# EAGLE board RAMBo (EAGLE 6.5.0), part 1 of 3
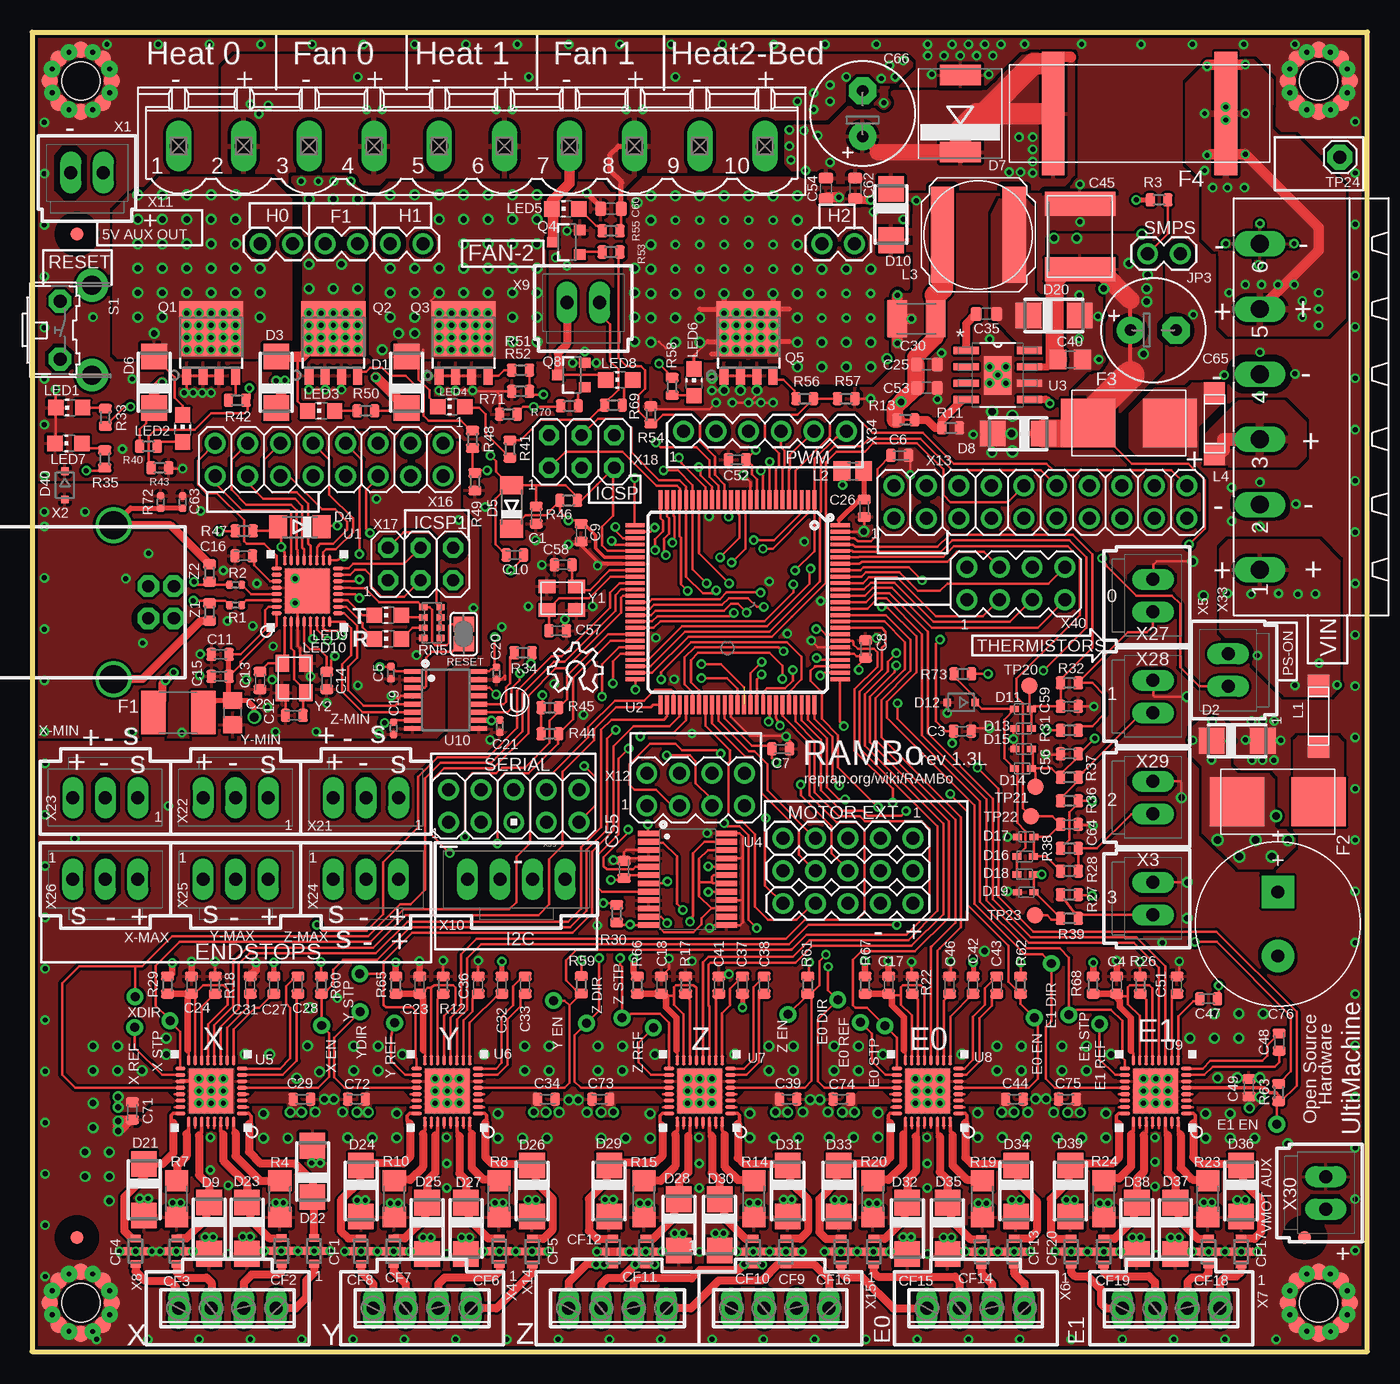
[diagram p1: board, top side]
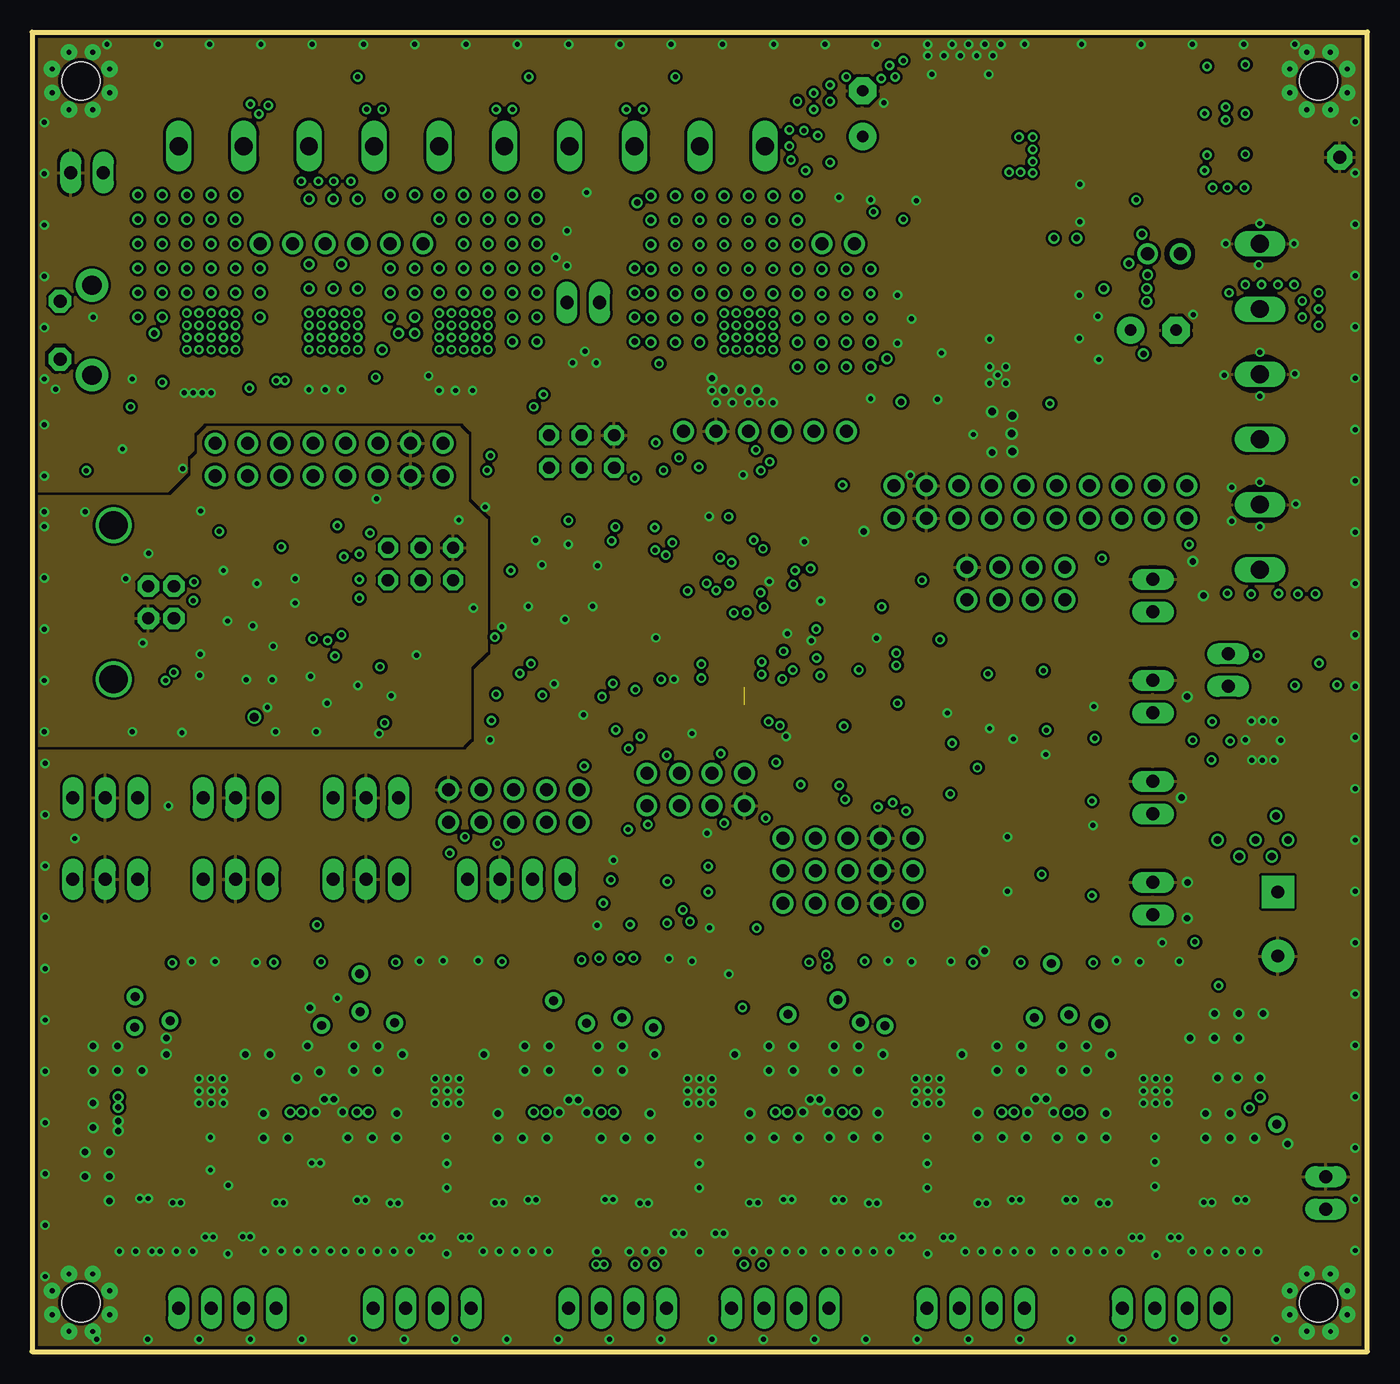
[diagram p2: board, inner layer 2-GND]
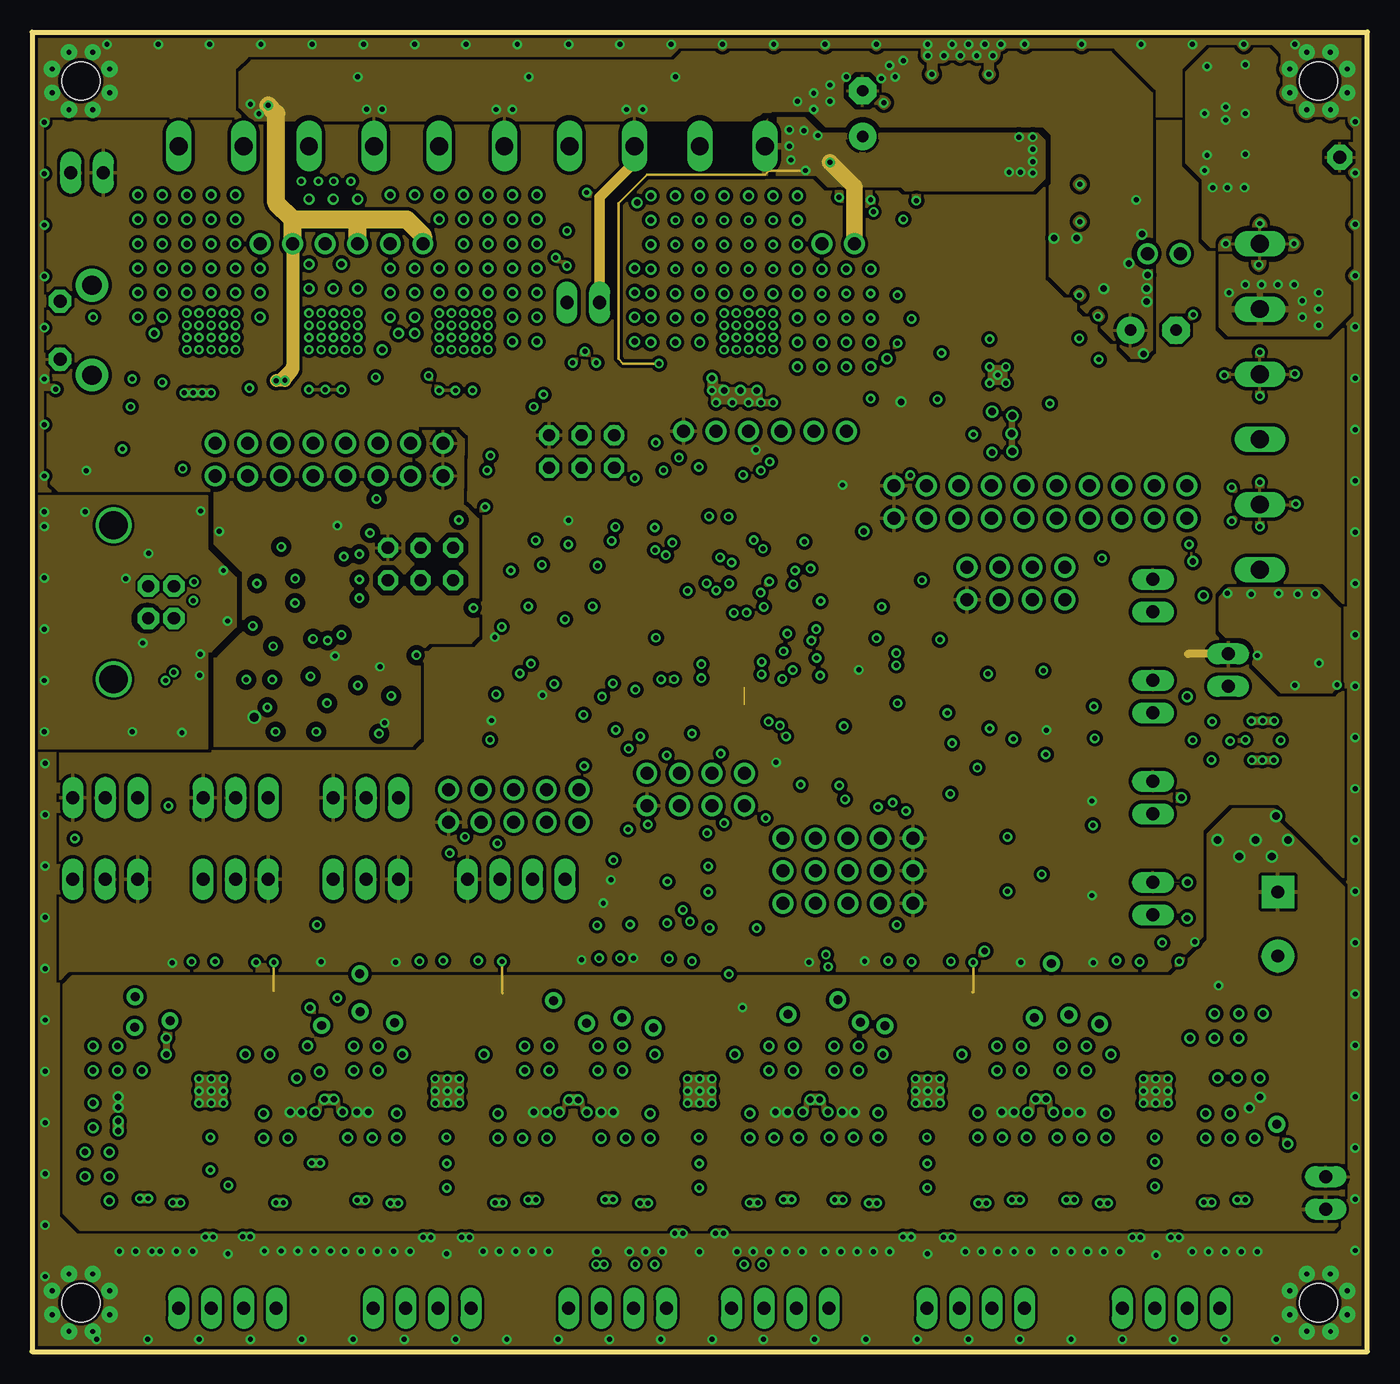
[diagram p3: board, inner layer 15-SUPPLY]
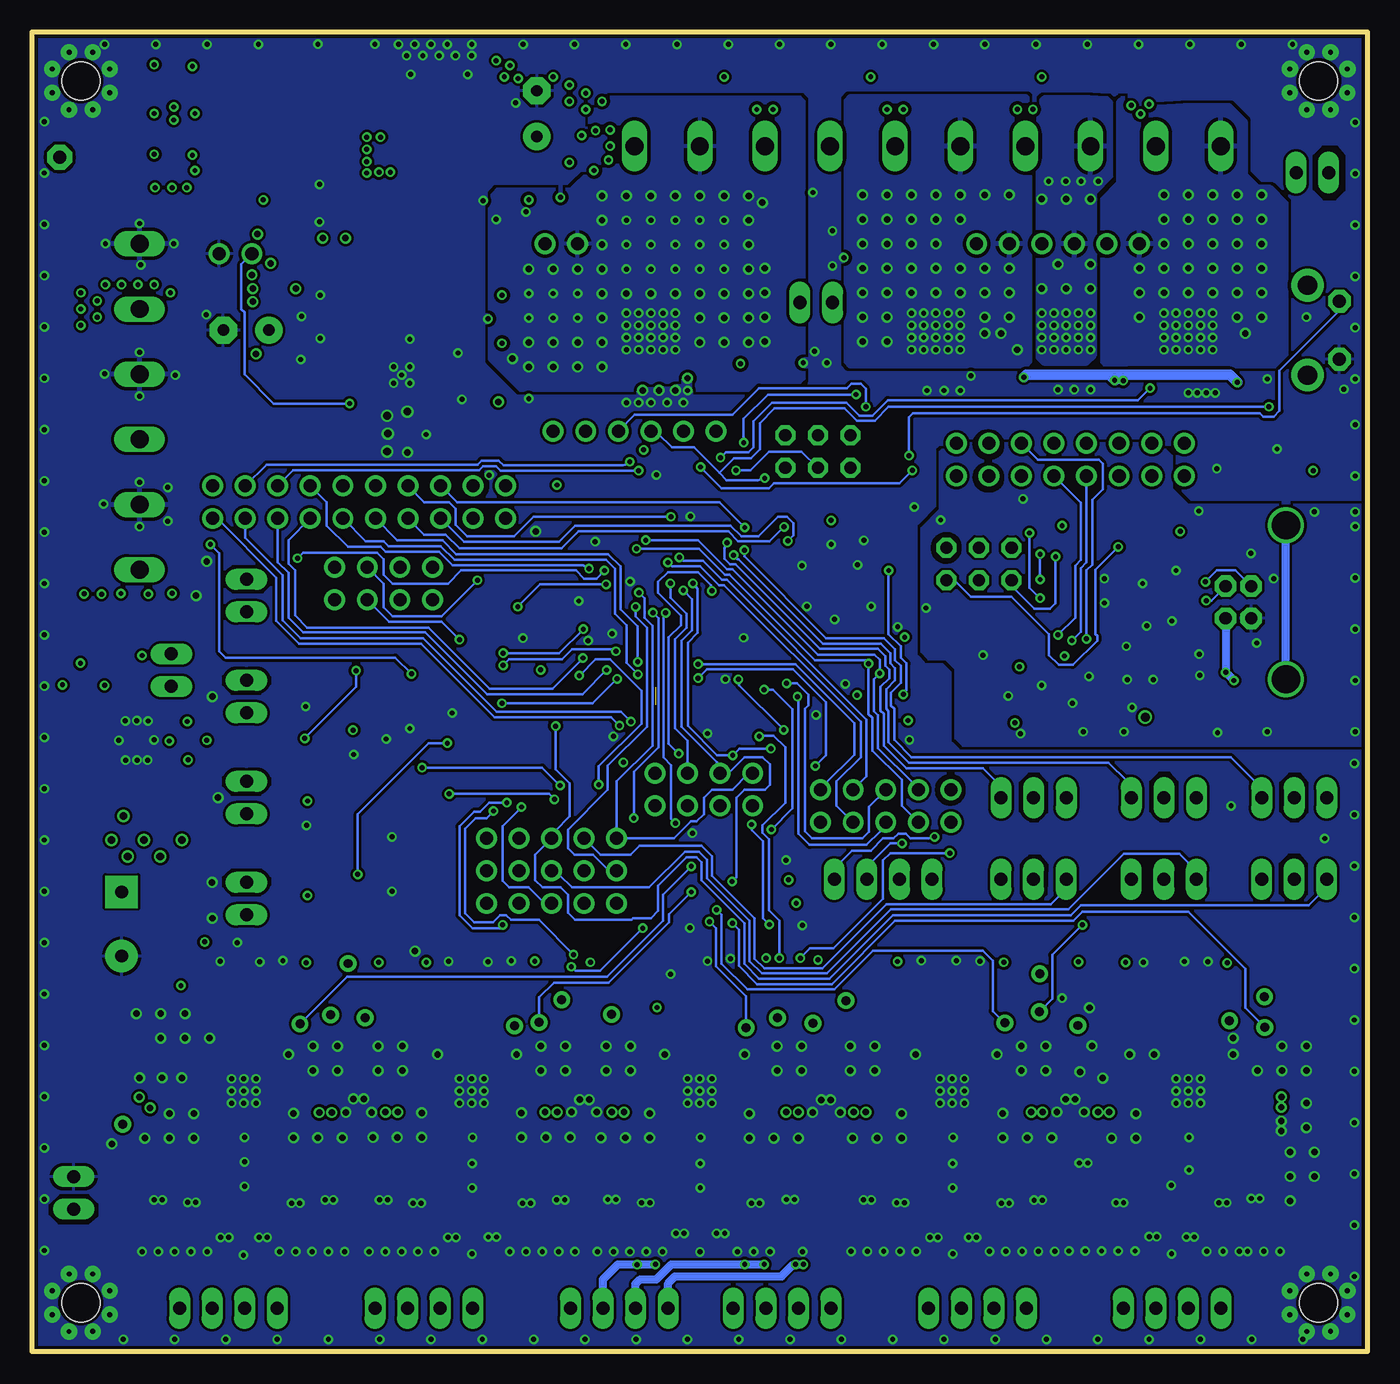
[diagram p4: board, bottom side, seen from below]

Size 104.14 x 102.87 mm. Coordinates in mm from the lower left corner, seen from the top.
Outline: 0,0 104.14,0 104.14,102.87 0,102.87 0,0
Copper layers (1*2+15*16): Top 0.07mm / dielectric 0.6mm / 2-GND 0.035mm / dielectric 0.2mm / 15-SUPPLY 0.035mm / dielectric 0.6mm / Bottom 0.07mm
Design rules "rambo4layer1-2f *": minimum track width 7mil, minimum drill 15mil, track to track 7mil, track to pad 7mil, pad to pad 7mil, via to via 7mil, smd to smd 7mil, copper to edge 10mil, drill to drill 8mil, minimum pad ring 12mil, minimum via ring 7mil, stop-mask expansion 3mil, vias tented up to drill 25mil, thermal gap 10mil
Net classes: 0 default: width 0.178 mm, drill 0.381 mm, clearance 0.178 mm; 1 power: width 0.203 mm, drill 0.381 mm, clearance 0.178 mm; 2 gnd: width 0.203 mm, drill 0.381 mm, clearance 0.178 mm; 3 power usb: width 0.203 mm, drill 0.381 mm, clearance 0.178 mm
tRestrict: area 93.5,75 to 98,77.4

## Footprints (pad centres in the part's own frame; a part is rotated, then mirrored left to right if it is on the bottom)
C0603 = smd 0.74 x 1: 1 -0.68,0; 2 0.68,0
C0805 = smd 1.3 x 1.5: 1 -0.95,0; 2 0.95,0
C0402 = smd 0.55 x 0.6: 1 -0.475,0; 2 0.475,0
C0603' = smd 0.85 x 1.1: 1 -0.8,0; 2 0.8,0
C1210K = smd 1.5 x 2.9: 1 -1.5,0; 2 1.5,0
C2220K = smd 1.85 x 5.5: 1 -2.55,0; 2 2.55,0
E3,5-8 = drill 0.889 pad 2.134: + -1.778,0 | drill 0.889 pad 2.134 octagon: - 1.778,0
C12,5-5 = drill 1 pad 2.54 square: + 2.5,0 | drill 1 pad 2.54: - -2.5,0
NFM21C = smd 0.6 x 0.8: 1 -1,0; 3 1,0 | smd 0.6 x 0.65: 2@1 0,-0.625; 2@2 0,0.625
SMA-SM = smd 2 x 2: A 2,0; C -2,0
MINIMELF = smd 1.4 x 1.8: A 1.7,0; C -1.7,0
DO-214AB = smd 1.6 x 3.2: A 3,0; C -3,0
SOD523 = smd 0.7 x 0.5: A 0.7,0; C -0.6,0
SOD323-R = smd 0.6 x 0.6: A 1.1,0; C -1.1,0
L1812 = smd 1.9 x 3.4: 1 -1.95,0; 2 1.95,0
OMNI-BLOK = smd 4.24 x 3.81: P$1 3.185,0; P$2 -3.185,0
FUSE-ATO-SMD = smd 1.778 x 9.652: P$1 -6.731,0; P$2 6.731,0
FIDUCIAL-1X2.5 = smd 1 x 1: 1 0,0
3,0-WAVE-HOLE = smd 1.27 x 1.27: P$1 0,2.413; P$2 2.413,0; P$3 0,-2.413; P$4 -2.413,0; P$5 1.714,1.714; P$6 -1.714,1.714; P$7 1.714,-1.714; P$8 -1.714,-1.714 | drill 0.381 pad 1.27: P$17 -2.248,0.933; P$18 -0.927,2.242; P$19 0.921,2.242; P$20 2.235,0.927; P$21 2.242,-0.921; P$22 0.927,-2.242; P$23 -0.927,-2.235; P$24 -2.242,-0.921 | hole 3: 0,0
SJ = smd 1.168 x 1.6: 1 -0.762,0; 2 0.762,0
1X02 = drill 1.016: 1 0,0; 2 2.54,0
L1806 = smd 1.75 x 1.65: P$1 -2.375,0; P$2 2.375,0
C0805' = smd 1.3 x 1.5: 1 -0.85,0; 2 0.85,0
NR8040 = smd 1.8 x 7.5: P$1 -2.8,0; P$2 2.8,0
CHIP-LED0805 = smd 1.2 x 1.2: A 0,-1.05; C 0,1.05
SOT669 = smd 0.7 x 1.4: 1 -1.905,-2.55; 2 -0.635,-2.55; 3 0.635,-2.55; 4 1.905,-2.55 | smd 5 x 4.3: MB 0,1.1
SOT23-3 = smd 0.8 x 0.9: 1 -0.95,-1; 2 0.95,-1; 3 0,1.1
R0402 = smd 0.54 x 0.6: 1 -0.48,0; 2 0.48,0
R0603 = smd 0.74 x 1: 1 -0.68,0; 2 0.68,0
R1206 = smd 1.6 x 1.803: 1 -1.422,0; 2 1.422,0
CAY16 = smd 0.5 x 0.65: 1 -1.2,-0.675; 2 -0.4,-0.675; 3 0.4,-0.675; 4 1.2,-0.675; 5 1.2,0.675; 6 0.4,0.675; 7 -0.4,0.675; 8 -1.2,0.675
B3F-31XX = drill 1.016 pad 1.778 octagon: 1 -2.261,-1.245; 2 2.261,-1.245 | drill 1.499 pad 2.54: 3 -3.505,1.245; 4 3.505,1.245
B1,27TH = drill 0.7 pad 1.27: TP 0,0
B1,27 = smd 1.27 x 1.27: TP 0,0
1X01 = drill 1.016 pad 1.93 octagon: 1 0,0
QFN32TROUND = smd 0.8 x 0.28: 1 -2.4,1.75; 2 -2.4,1.25; 3 -2.4,0.75; 4 -2.4,0.25; 5 -2.4,-0.25; 6 -2.4,-0.75; 7 -2.4,-1.25; 8 -2.4,-1.75; 17 2.4,-1.75; 18 2.4,-1.25; 19 2.4,-0.75; 20 2.4,-0.25; 21 2.4,0.25; 22 2.4,0.75; 23 2.4,1.25; 24 2.4,1.75 | smd 0.28 x 0.8: 9 -1.75,-2.4; 10 -1.25,-2.4; 11 -0.75,-2.4; 12 -0.25,-2.4; 13 0.25,-2.4; 14 0.75,-2.4; 15 1.25,-2.4; 16 1.75,-2.4; 25 1.75,2.4; 26 1.25,2.4; 27 0.75,2.4; 28 0.25,2.4; 29 -0.25,2.4; 30 -0.75,2.4; 31 -1.25,2.4; 32 -1.75,2.4 | smd 3.465 x 3.465: 33 0,0
TQFP100 = smd 1.5 x 0.3: 1 -8,6; 2 -8,5.5; 3 -8,5; 4 -8,4.5; 5 -8,4; 6 -8,3.5; 7 -8,3; 8 -8,2.5; 9 -8,2; 10 -8,1.5; 11 -8,1; 12 -8,0.5; 13 -8,0; 14 -8,-0.5; 15 -8,-1; 16 -8,-1.5; 17 -8,-2; 18 -8,-2.5; 19 -8,-3; 20 -8,-3.5; 21 -8,-4; 22 -8,-4.5; 23 -8,-5; 24 -8,-5.5; 25 -8,-6; 51 8,-6; 52 8,-5.5; 53 8,-5; 54 8,-4.5; 55 8,-4; 56 8,-3.5; 57 8,-3; 58 8,-2.5; 59 8,-2; 60 8,-1.5; 61 8,-1; 62 8,-0.5; 63 8,0; 64 8,0.5; 65 8,1; 66 8,1.5; 67 8,2; 68 8,2.5; 69 8,3; 70 8,3.5; 71 8,4; 72 8,4.5; 73 8,5; 74 8,5.5; 75 8,6 | smd 0.3 x 1.5: 26 -6,-8; 27 -5.5,-8; 28 -5,-8; 29 -4.5,-8; 30 -4,-8; 31 -3.5,-8; 32 -3,-8; 33 -2.5,-8; 34 -2,-8; 35 -1.5,-8; 36 -1,-8; 37 -0.5,-8; 38 0,-8; 39 0.5,-8; 40 1,-8; 41 1.5,-8; 42 2,-8; 43 2.5,-8; 44 3,-8; 45 3.5,-8; 46 4,-8; 47 4.5,-8; 48 5,-8; 49 5.5,-8; 50 6,-8; 76 6,8; 77 5.5,8; 78 5,8; 79 4.5,8; 80 4,8; 81 3.5,8; 82 3,8; 83 2.5,8; 84 2,8; 85 1.5,8; 86 1,8; 87 0.5,8; 88 0,8; 89 -0.5,8; 90 -1,8; 91 -1.5,8; 92 -2,8; 93 -2.5,8; 94 -3,8; 95 -3.5,8; 96 -4,8; 97 -4.5,8; 98 -5,8; 99 -5.5,8; 100 -6,8
SOIC127P600X170-9N = smd 1.981 x 0.559: 1 -2.464,1.905; 2 -2.464,0.635; 3 -2.464,-0.635; 4 -2.464,-1.905; 5 2.464,-1.905; 6 2.464,-0.635; 7 2.464,0.635; 8 2.464,1.905 | smd 2.134 x 2.997: 9 0,-0.051
TSSOP24 = smd 1.635 x 0.44: P01 -3.05,3.575; P02 -3.05,2.925; P03 -3.05,2.275; P04 -3.05,1.625; P05 -3.05,0.975; P06 -3.05,0.325; P07 -3.05,-0.325; P08 -3.05,-0.975; P09 -3.05,-1.625; P10 -3.05,-2.275; P11 -3.05,-2.925; P12 -3.05,-3.575; P13 3.05,-3.575; P14 3.05,-2.925; P15 3.05,-2.275; P16 3.05,-1.625; P17 3.05,-0.975; P18 3.05,-0.325; P19 3.05,0.325; P20 3.05,0.975; P21 3.05,1.625; P22 3.05,2.275; P23 3.05,2.925; P24 3.05,3.575
QSOP16 = smd 0.381 x 1.27: 1 -2.223,-2.6; 2 -1.587,-2.6; 3 -0.953,-2.6; 4 -0.318,-2.6; 5 0.318,-2.6; 6 0.953,-2.6; 7 1.587,-2.6; 8 2.223,-2.6; 9 2.223,2.6; 10 1.587,2.6; 11 0.953,2.6; 12 0.318,2.6; 13 -0.318,2.6; 14 -0.953,2.6; 15 -1.587,2.6; 16 -2.223,2.6
70543-02 = drill 1.016 long: 1 -1.27,0; 2 1.27,0
PN61729 = drill 0.95 pad 1.676 octagon: 1 1.25,4.71; 2 -1.25,4.71; 3 -1.25,2.71; 4 1.25,2.71 | drill 2.2: P$1 -6,0; P$2 6,0
4POL254 = drill 1.016 long: 1 -3.81,0; 2 -1.27,0; 3 1.27,0; 4 3.81,0
70543-04 = drill 1.016 long: 1 -3.81,0; 2 -1.27,0; 3 1.27,0; 4 3.81,0
MSTBV10 = drill 1.397 long: 1 -22.86,0; 2 -17.78,0; 3 -12.7,0; 4 -7.62,0; 5 -2.54,0; 6 2.54,0; 7 7.62,0; 8 12.7,0; 9 17.78,0; 10 22.86,0
2X4 = drill 1.016: 1 -3.81,-1.27; 2 -3.81,1.27; 3 -1.27,-1.27; 4 -1.27,1.27; 5 1.27,-1.27; 6 1.27,1.27; 7 3.81,-1.27; 8 3.81,1.27
2X10 = drill 1.016: 1 -11.43,-1.27; 2 -11.43,1.27; 3 -8.89,-1.27; 4 -8.89,1.27; 5 -6.35,-1.27; 6 -6.35,1.27; 7 -3.81,-1.27; 8 -3.81,1.27; 9 -1.27,-1.27; 10 -1.27,1.27; 11 1.27,-1.27; 12 1.27,1.27; 13 3.81,-1.27; 14 3.81,1.27; 15 6.35,-1.27; 16 6.35,1.27; 17 8.89,-1.27; 18 8.89,1.27; 19 11.43,-1.27; 20 11.43,1.27
2X8 = drill 1.016: 1 0,0; 2 0,2.54; 3 2.54,0; 4 2.54,2.54; 5 5.08,0; 6 5.08,2.54; 7 7.62,0; 8 7.62,2.54; 9 10.16,0; 10 10.16,2.54; 11 12.7,0; 12 12.7,2.54; 13 15.24,0; 14 15.24,2.54; 15 17.78,0; 16 17.78,2.54
2X03 = drill 0.95 pad 1.55 octagon: 1 -2.54,-1.27; 2 -2.54,1.27; 3 0,-1.27; 4 0,1.27; 5 2.54,-1.27; 6 2.54,1.27
1X05 = drill 1.016: 1 0,0; 2 2.54,0; 3 5.08,0; 4 7.62,0; 5 10.16,0
70543-03 = drill 1.016 long: 1 -2.54,0; 2 0,0; 3 2.54,0
MSTBA6 = drill 1.397 long: 1 -12.7,5.08; 2 -7.62,5.08; 3 -2.54,5.08; 4 2.54,5.08; 5 7.62,5.08; 6 12.7,5.08
1X06 = drill 1.016: 1 0,0; 2 2.54,0; 3 5.08,0; 4 7.62,0; 5 10.16,0; 6 12.7,0
AVR_ICSP = drill 1.016: 1 -1.27,5.08; 2 1.27,5.08; 3 -1.27,2.54; 4 1.27,2.54; 5 -1.27,0; 6 1.27,0; 7 -1.27,-2.54; 8 1.27,-2.54; 9 -1.27,-5.08; 10 1.27,-5.08
CRYSTAL-3.2-2.5 = smd 1.3 x 1.05: 1 -1.15,-0.925; 2 1.15,-0.925; 3 1.15,0.925; 4 -1.15,0.925

## Placement (x,y rotation side)
C1  22pF  [C0603]  39.31,65.21 270 top
C2  10uF  [C0805]  15.65,49.82 90 top
C3  100nF  [C0603]  72.55,48.38 0 top
C4  100nF  [C0603]  84.58,28.57 90 top
C5  100nF  [C0402]  27.99,52.93 270 top
C6  100nF  [C0603]  67.66,69.86 0 top
C7  100nF  [C0603]  58.39,46.99 0 top
C8  100nF  [C0603]  65,54.78 90 top
C9  100nF  [C0603]  42.82,63.84 270 top
C10  100nF  [C0603]  37.66,62.1 180 top
C11  100nF  [C0603]  14.67,54.36 180 top
C12  22pF  [C0603]  20.45,49.59 180 top
C13  22pF  [C0603]  17.78,52.32 270 top
C14  100nF  [C0603]  22.99,52.32 270 top
C15  100nF  [C0603]  14.67,52.64 180 top
C16  1uF  [C0603]  16.51,62.04 180 top
C17  100nF  [C0603]  66.8,28.57 90 top
C18  100nF  [C0603]  49.09,28.57 90 top
C19  100nF  [C0402]  28.19,48.59 270 top
C20  100nF  [C0402]  36.22,52.88 270 top
C21  100nF  [C0402]  36.47,48.77 90 top
C23  100nF  [C0603]  30.23,28.57 90 top
C24  100nF  [C0603]  12.45,28.57 90 top
C25  100nF  [C0603']  69.79,76.96 0 top
C26  100nF  [C0603]  64.9,65.75 270 top
C27  100nF  [C0603]  18.86,28.57 270 top
C28  100nF  [C0603]  20.73,28.57 90 top
C29  100nF  [C0603]  21.05,19.68 0 top
C30  10uF  [C1210K]  68.96,80.52 180 top
C31  0.22uF  [C0603]  17.02,28.57 270 top
C32  100nF  [C0603]  36.64,28.57 270 top
C33  100nF  [C0603]  38.45,28.57 90 top
C34  100nF  [C0603]  40.1,19.68 0 top
C35  10nF  [C0603']  74.42,80.9 0 top
C36  0.22uF  [C0603]  34.8,28.57 270 top
C37  100nF  [C0603]  55.4,28.57 90 top
C38  100nF  [C0603]  57.09,28.57 90 top
C39  100nF  [C0603]  58.96,19.68 0 top
C40  1uF  [C0805]  80.96,77.34 0 top
C41  0.22uF  [C0603]  53.56,28.57 270 top
C42  100nF  [C0603]  73.38,28.57 270 top
C43  100nF  [C0603]  75.24,28.57 90 top
C44  100nF  [C0603]  76.61,19.68 0 top
C45  10uF  [C2220K]  81.72,86.93 90 top
C46  0.22uF  [C0603]  71.56,28.57 270 top
C47  100nF  [C0603]  91.74,27.5 180 top
C48  100nF  [C0603]  97.25,24.13 90 top
C49  100nF  [C0603]  94.89,20.57 90 top
C51  0.22uF  [C0603]  89.28,28.57 270 top
C52  100nF  [C0603]  54.99,69.53 180 top
C53  10nF  [C0603']  69.79,75.12 0 top
C54  10nF  [C0603']  61.91,90.68 270 top
C55  100nF  [C0603]  46.16,37.59 90 top
C56  100nF  [C0603]  80.9,46.6 180 top
C57  22pF  [C0603]  40.99,56.2 0 top
C58  22pF  [C0603]  41.43,61.34 180 top
C59  100nF  [C0603]  80.9,50.3 0 top
C60  100nF  [C0603']  45.15,89.09 180 top
C62  100nF  [C0603']  64.2,90.68 270 top
C63  4.7nF  [C0402]  11.75,66.23 90 top
C64  100nF  [C0603]  80.9,41.1 0 top
C65  100uF  [E3,5-8]  87.44,79.63 0 top
C66  100uF  [E3,5-8]  64.77,96.52 90 top
C71  100nF  [C0603]  7.82,18.76 270 top
C72  100nF  [C0603]  25.3,19.68 180 top
C73  100nF  [C0603]  44.35,19.68 180 top
C74  100nF  [C0603]  63.15,19.68 180 top
C75  100nF  [C0603]  80.74,19.68 180 top
C76  470uF  [C12,5-5]  97.16,33.34 90 top
CF1  NFM21C  [NFM21C]  22,7.85 270 top
CF2  NFM21C  [NFM21C]  19.46,7.85 270 top
CF3  NFM21C  [NFM21C]  11.28,7.82 270 top
CF4  NFM21C  [NFM21C]  8.08,7.82 270 top
CF5  NFM21C  [NFM21C]  39.01,7.8 270 top
CF6  NFM21C  [NFM21C]  36.45,7.82 270 top
CF7  NFM21C  [NFM21C]  28.19,7.82 270 top
CF8  NFM21C  [NFM21C]  25.65,7.82 270 top
CF9  NFM21C  [NFM21C]  58.78,7.8 270 top
CF10  NFM21C  [NFM21C]  56.24,7.8 270 top
CF11  NFM21C  [NFM21C]  47.85,7.8 270 top
CF12  NFM21C  [NFM21C]  45.31,7.8 270 top
CF13  NFM21C  [NFM21C]  76.58,7.8 270 top
CF14  NFM21C  [NFM21C]  74.04,7.77 270 top
CF15  NFM21C  [NFM21C]  65.63,7.8 270 top
CF16  NFM21C  [NFM21C]  63.09,7.8 270 top
CF17  NFM21C  [NFM21C]  94.28,7.8 270 top
CF18  NFM21C  [NFM21C]  91.74,7.8 270 top
CF19  NFM21C  [NFM21C]  83.57,7.8 270 top
CF20  NFM21C  [NFM21C]  81.03,7.8 270 top
D1  SK310A-TP  [SMA-SM]  29.21,75.56 90 top
D2  SK310A-TP  [SMA-SM]  93.98,47.62 0 top
D3  SK310A-TP  [SMA-SM]  19.05,75.56 90 top
D4  CD1206-S01575  [MINIMELF]  20.89,64.29 180 top
D5  CD1206-S01575  [MINIMELF]  37.4,65.85 90 top
D6  SK310A-TP  [SMA-SM]  9.53,75.56 90 top
D7  S3A  [DO-214AB]  72.39,96.52 90 top
D8  SK310A-TP  [SMA-SM]  76.9,71.56 180 top
D9  SMAJ30A  [SMA-SM]  13.82,9.63 270 top
D10  SK310A-TP  [SMA-SM]  66.99,88.65 270 top
D11  1N4148WT  [SOD523]  77.22,50.1 0 top
D12  SZMM3Z4V7T1G  [SOD323-R]  72.45,50.61 180 top
D13  1N4148WT  [SOD523]  77.34,48.58 180 top
D14  1N4148WT  [SOD523]  77.22,45.47 0 top
D15  1N4148WT  [SOD523]  77.34,46.99 180 top
D16  1N4148WT  [SOD523]  77.41,38.61 0 top
D17  1N4148WT  [SOD523]  77.53,40.13 180 top
D18  1N4148WT  [SOD523]  77.41,37.21 0 top
D19  1N4148WT  [SOD523]  77.53,35.81 180 top
D20  SK310A-TP  [SMA-SM]  79.69,80.77 0 top
D21  SMAJ30A  [SMA-SM]  8.74,12.62 270 top
D22  SMAJ30A  [SMA-SM]  21.87,14.05 90 top
D23  SMAJ30A  [SMA-SM]  16.76,9.63 270 top
D24  SMAJ30A  [SMA-SM]  25.65,12.52 270 top
D25  SMAJ30A  [SMA-SM]  30.81,9.6 270 top
D26  SMAJ30A  [SMA-SM]  38.99,12.52 270 top
D27  SMAJ30A  [SMA-SM]  33.83,9.6 270 top
D28  SMAJ30A  [SMA-SM]  50.44,9.88 270 top
D29  SMAJ30A  [SMA-SM]  45.01,12.52 270 top
D30  SMAJ30A  [SMA-SM]  53.62,9.88 270 top
D31  SMAJ30A  [SMA-SM]  58.93,12.52 270 top
D32  SMAJ30A  [SMA-SM]  68.25,9.6 270 top
D33  SMAJ30A  [SMA-SM]  62.92,12.52 270 top
D34  SMAJ30A  [SMA-SM]  76.73,12.52 270 top
D35  SMAJ30A  [SMA-SM]  71.4,9.6 270 top
D36  SMAJ30A  [SMA-SM]  94.28,12.52 270 top
D37  SMAJ30A  [SMA-SM]  89.15,9.6 270 top
D38  SMAJ30A  [SMA-SM]  86.16,9.6 270 top
D39  SMAJ30A  [SMA-SM]  80.98,12.52 270 top
D40  RSB39VTE-17  [SOD323-R]  2.57,67.54 270 top
F1  MF-MSMF050-2 500mA  [L1812]  11.4,49.82 180 top
F2  OMNI-BLOK  [OMNI-BLOK]  97.16,42.86 0 top
F3  OMNI-BLOK  [OMNI-BLOK]  85.55,72.39 0 top
F4  FUSE  [FUSE-ATO-SMD]  86.36,96.52 180 top
FID1  FIDUCIAL1X2.5  [FIDUCIAL-1X2.5]  3.49,87.12 0 top
FID2  FIDUCIAL1X2.5  [FIDUCIAL-1X2.5]  3.49,8.89 0 top
FID3  FIDUCIAL1X2.5  [FIDUCIAL-1X2.5]  99.25,8.89 0 top
H1  WAVE-HOLE  [3,0-WAVE-HOLE]  3.81,3.81 0 top
H2  WAVE-HOLE  [3,0-WAVE-HOLE]  100.33,3.81 0 top
H3  WAVE-HOLE  [3,0-WAVE-HOLE]  3.81,99.06 0 top
H4  WAVE-HOLE  [3,0-WAVE-HOLE]  100.33,99.06 0 top
JP2  [SJ]  33.66,55.94 270 top
JP3  [1X02]  89.53,85.6 180 top
L1  BLM41PG600SN1  [L1806]  100.33,49.53 270 top
L2  10uH  [C0805']  64.01,68.64 0 top
L3  33uH  [NR8040]  73.79,87.06 180 top
L4  BLM41PG600SN1  [L1806]  92.2,72.34 90 top
LED1  YELLOW  [CHIP-LED0805]  2.9,73.59 90 top
LED2  RED  [CHIP-LED0805]  11.75,71.95 0 top
LED3  RED  [CHIP-LED0805]  22.54,73.34 90 top
LED4  RED  [CHIP-LED0805]  32.7,73.66 90 top
LED5  RED  [CHIP-LED0805]  41.59,89.09 90 top
LED6  RED  [CHIP-LED0805]  51.63,75.56 0 top
LED7  GREEN  [CHIP-LED0805]  2.84,70.8 90 top
LED8  RED  [CHIP-LED0805]  45.78,75.76 90 top
LED9  YELLOW  [CHIP-LED0805]  27.75,57.4 90 top
LED10  YELLOW  [CHIP-LED0805]  27.75,55.56 90 top
LOGO1  OSHW_LOGO_8MILX0150-NT  [OSHW_8X150_NOTEXT]  40.26,51.44 0 top
Q1  PSMN7R0-60YS  [SOT669]  13.97,78.64 0 top
Q2  PSMN7R0-60YS  [SOT669]  23.5,78.64 0 top
Q3  PSMN7R0-60YS  [SOT669]  33.66,78.64 0 top
Q4  IRLML6346TRPBF  [SOT23-3]  41.72,86.49 90 top
Q5  PSMN7R0-60YS  [SOT669]  55.88,78.64 0 top
Q8  IRLML6346TRPBF  [SOT23-3]  42.1,76.14 90 top
R1  22R  [R0402]  15.88,58.2 0 top
R2  22R  [R0402]  15.88,59.79 0 top
R3  470K  [R0603]  87.88,89.79 180 top
R4  0r1  [R1206]  19.32,11.9 270 top
R7  0r1  [R1206]  11.27,11.9 270 top
R8  0r1  [R1206]  36.42,11.9 270 top
R10  0r1  [R1206]  28.25,11.9 270 top
R11  NP  [R0603]  71.63,72.01 0 top
R12  0r  [R0603]  32.07,28.57 270 top
R13  NP  [R0603]  68.14,72.64 180 top
R14  0r1  [R1206]  56.29,11.9 270 top
R15  0r1  [R1206]  47.73,11.9 270 top
R17  0r  [R0603]  50.96,28.57 270 top
R18  0r  [R0603]  14.29,28.57 270 top
R19  0r1  [R1206]  74.11,11.9 270 top
R20  0r1  [R1206]  65.59,11.9 270 top
R22  0r  [R0603]  68.64,28.57 270 top
R23  0r1  [R1206]  91.69,11.9 270 top
R24  0r1  [R1206]  83.57,11.9 270 top
R26  0r  [R0603]  86.42,28.57 270 top
R27  4K7  [R0603]  80.9,35.62 0 top
R28  4K7  [R0603]  80.9,37.47 0 top
R29  56r  [R0603]  10.57,28.57 90 top
R30  3.3K  [R0603]  45.59,34.14 270 top
R31  4K7  [R0603]  80.9,48.44 180 top
R32  4K7  [R0603]  80.9,52.13 0 top
R33  1K  [R0603]  5.71,72.83 90 top
R34  1K  [R0603]  38.29,54.48 0 top
R35  1K  [R0603]  5.67,69.59 90 top
R36  4K7  [R0603]  80.9,42.94 0 top
R37  4K7  [R0603]  80.9,44.77 0 top
R38  4K7  [R0603]  80.9,39.23 180 top
R39  4K7  [R0603]  80.9,33.78 0 top
R40  1.8K  [R0603]  9.08,70.58 180 top
R41  1.8K  [R0603]  37.27,70.36 90 top
R42  10r  [R0603]  16,74.17 180 top
R43  100K  [R0603]  9.97,68.9 0 top
R44  10K  [R0603]  40.39,48.16 180 top
R45  10K  [R0603]  40.39,50.2 180 top
R46  10K  [R0603]  41.85,66.36 180 top
R47  10K  [R0603]  16.54,63.98 180 top
R48  10r  [R0603]  34.35,71.12 90 top
R49  100K  [R0603]  34.54,67.82 270 top
R50  1.8K  [R0603]  26.04,73.34 0 top
R51  10r  [R0603]  38.1,76.52 180 top
R52  100K  [R0603]  38.1,74.87 180 top
R53  10r  [R0603]  45.15,85.72 180 top
R54  100K  [R0603]  48.26,73.03 90 top
R55  1.8K  [R0603]  45.15,87.38 0 top
R56  10r  [R0603]  60.26,74.3 180 top
R57  100K  [R0603]  63.5,74.3 0 top
R58  1.8K  [R0603]  49.91,75.25 90 top
R59  100K  [R0603]  42.83,28.59 270 top
R60  100K  [R0603]  22.58,28.57 270 top
R61  100K  [R0603]  60.49,28.57 270 top
R62  100K  [R0603]  77.09,28.57 270 top
R63  100K  [R0603]  97.22,20.19 270 top
R65  56r  [R0603]  28.38,28.57 90 top
R66  56r  [R0603]  47.21,28.57 90 top
R67  56r  [R0603]  64.96,28.57 90 top
R68  56r  [R0603]  82.74,28.57 90 top
R69  1.8K  [R0603]  45.34,73.79 180 top
R70  10r  [R0603]  41.91,73.72 0 top
R71  100K  [R0603]  37.15,73.09 180 top
R72  1M  [R0402]  10.03,66.23 270 top
R73  10K  [R0603]  72.58,52.83 0 top
RN5  1k  [CAY16]  31.18,56.83 90 top
S1  [B3F-31XX]  3.43,79.63 270 top
TP0  PTR1B1,27TH  [B1,27TH]  25.58,26.51 0 top
TP1  PTR1B1,27TH  [B1,27TH]  8.03,27.67 0 top
TP2  PTR1B1,27TH  [B1,27TH]  10.76,25.79 0 top
TP3  PTR1B1,27TH  [B1,27TH]  8,25.27 0 top
TP4  PTR1B1,27TH  [B1,27TH]  22.59,25.43 0 top
TP5  PTR1B1,27TH  [B1,27TH]  25.56,29.46 0 top
TP6  PTR1B1,27TH  [B1,27TH]  28.28,25.62 0 top
TP7  PTR1B1,27TH  [B1,27TH]  40.67,27.37 0 top
TP8  PTR1B1,27TH  [B1,27TH]  46.01,26.01 0 top
TP9  PTR1B1,27TH  [B1,27TH]  48.45,25.24 0 top
TP10  PTR1B1,27TH  [B1,27TH]  58.96,26.29 0 top
TP11  PTR1B1,27TH  [B1,27TH]  62.83,27.43 0 top
TP12  PTR1B1,27TH  [B1,27TH]  64.59,25.66 0 top
TP13  PTR1B1,27TH  [B1,27TH]  66.52,25.39 0 top
TP14  PTR1B1,27TH  [B1,27TH]  78.17,26.04 0 top
TP15  PTR1B1,27TH  [B1,27TH]  79.49,30.26 0 top
TP16  PTR1B1,27TH  [B1,27TH]  80.86,26.25 0 top
TP17  PTR1B1,27TH  [B1,27TH]  83.25,25.55 0 top
TP18  PTR1B1,27TH  [B1,27TH]  97.07,17.72 0 top
TP19  PTR1B1,27TH  [B1,27TH]  43.23,25.59 0 top
TP20  PTR1B1,27  [B1,27]  77.76,51.92 0 top
TP21  PTR1B1,27  [B1,27]  78.25,44.05 0 top
TP22  PTR1B1,27  [B1,27]  77.91,41.73 0 top
TP23  PTR1B1,27  [B1,27]  78.2,34.01 0 top
TP24  GND  [1X01]  101.99,93.12 0 top
U1  ATMEGA32U2-MUR  [QFN32TROUND]  21.46,59.31 90 top
U2  ATMEGA2560-16AU  [TQFP100]  55.02,58.42 270 top
U3  LM22675  [SOIC127P600X170-9N]  75.31,76.14 0 top
U4  AD5206  [TSSOP24]  51.12,36.83 0 top
U5  A4982  [QFN32TROUND]  13.97,20.32 180 top
U6  A4982  [QFN32TROUND]  32.38,20.32 180 top
U7  A4982  [QFN32TROUND]  52.07,20.32 180 top
U8  A4982  [QFN32TROUND]  69.85,20.32 180 top
U9  A4982  [QFN32TROUND]  87.63,20.32 180 top
U10  ADUM7441  [QSOP16]  32.26,50.8 270 top
X1  C-GRID-02-70543  [70543-02]  4.29,91.92 0 top
X2  USB B-TH  [PN61729]  6.35,58.42 270 top
X3  C-GRID-02-70543  [70543-02]  87.41,35.31 270 top
X4  C-GRID-04-70543  [4POL254]  30.41,3.38 180 top
X5  C-GRID-02-70543  [70543-02]  93.27,53.13 90 top
X6  C-GRID-04-70543  [4POL254]  73.59,3.38 180 top
X7  C-GRID-04-70543  [4POL254]  88.83,3.38 180 top
X8  C-GRID-04-70543  [4POL254]  15.24,3.38 180 top
X9  C-GRID-02-70543  [70543-02]  42.99,81.79 0 top
X10  C-GRID-04-70543  [70543-04]  37.76,36.83 0 top
X11  MSTBV10  [MSTBV10]  34.29,93.98 0 top
X12  SPI  [2X4]  51.75,43.81 0 top
X13  EXT-2  [2X10]  78.63,66.22 0 top
X14  C-GRID-04-70543  [4POL254]  45.65,3.38 180 top
X15  C-GRID-04-70543  [4POL254]  58.35,3.38 180 top
X16  32u2 EXT  [2X8]  32.07,70.8 180 top
X17  3x2M  [2X03]  30.29,61.4 0 top
X18  3x2M  [2X03]  42.86,70.17 0 top
X20  MX1  [1X05]  68.71,34.94 180 top
X21  C-GRID-03-70543  [70543-03]  26.04,43.18 180 top
X22  C-GRID-03-70543  [70543-03]  15.88,43.18 180 top
X23  C-GRID-03-70543  [70543-03]  5.71,43.18 180 top
X24  C-GRID-03-70543  [70543-03]  26.04,36.83 0 top
X25  C-GRID-03-70543  [70543-03]  15.88,36.83 0 top
X26  C-GRID-03-70543  [70543-03]  5.71,36.83 0 top
X27  C-GRID-02-70543  [70543-02]  87.41,58.93 270 top
X28  C-GRID-02-70543  [70543-02]  87.41,51.06 270 top
X29  C-GRID-02-70543  [70543-02]  87.41,43.19 270 top
X30  C-GRID-02-70543  [70543-02]  100.89,12.38 270 top
X31  MX2  [1X05]  68.71,37.48 180 top
X32  MX3  [1X05]  68.71,40.02 180 top
X33  MSTBA6  [MSTBA6]  100.84,73.66 90 top
X34  PWM_EXT  [1X06]  50.8,71.75 0 top
X35  [1X02]  17.78,86.36 0 top
X36  [1X02]  22.86,86.36 0 top
X37  [1X02]  27.94,86.36 0 top
X38  [1X02]  61.59,86.36 0 top
X39  M05X2PTH  [AVR_ICSP]  37.56,42.55 90 top
X40  Analog  [2X4]  76.73,59.87 0 top
Y1  16MHz KX-7  [CRYSTAL-3.2-2.5]  41.31,58.74 0 top
Y2  16MHz KX-7  [CRYSTAL-3.2-2.5]  20.45,52.51 270 top
Z1  CG0603MLC-05E  [R0603]  13.84,57.66 90 top
Z2  CG0603MLC-05E  [R0603]  13.84,60.71 270 top

## Tracks (layer width: path | path; a pad name or v marks a point on that pad's centre or on a via)
+12V  (via drill 0.38, 0.5, 0.6)
  Top 0.203: C47.1 92.53,27.61 v92.53,28.54
  Top 0.406: C32.1 v36.64,30.41 | C37.1 v55.4,26.83 | v18.86,30.35 C27.1 | v73.39,30.35 73.39,29.44 C42.1
  15-SUPPLY 0.203: v18.86,30.35 18.86,28.13 | v36.64,30.41 36.64,28 36.7,27.94 | v73.39,30.35 73.39,28.02 73.41,28 73.34,28
  other vias: 93.43,47.6 95.42,39.88 92.46,39.88 97,41.76 91.97,46.14 92.04,49.12 21.02,18.67 6.71,19.86 40.07,18.67 25.34,18.67 58.93,18.67 44.39,18.67 76.58,18.67 63.18,18.67 81.74,18.64 95.77,19.84 90.51,47.66 6.72,19.05 20.14,18.67 26.21,18.67 39.12,18.67 45.34,18.67 57.98,18.67 64.14,18.67 75.63,18.67 80.76,18.64 94.95,19 97.96,39.88 94.15,38.61 96.69,38.61
  pour 15-SUPPLY (isolate 0.254, rank 2): 102.23,10.31 101.45,9.53 3.81,9.53 2.54,10.79 2.54,17.78 2.54,28.57 3.17,29.21 88.9,29.21 91.76,32.07 91.76,40.32 93.68,42.24 96.82,42.24 97.16,41.91 97.16,41.27 98.42,40.01 102.23,36.2
  pour Top (no thermals): 6.76,18.78 8.5,18.78 9.14,19.43 10.99,19.43 11.11,19.56 11.81,19.57 11.13,19.57 10.54,20.13 6.73,20.13 6.54,19.94 6.54,19.1 6.57,18.97
  pour Top (no thermals): 21.11,18.39 21.06,18.34 20.14,18.34 19.96,18.52 19.96,19.3 19.84,19.43 16.99,19.43 16.87,19.56 16.26,19.56 16.28,19.58 16.79,19.58 17.4,20.19 19.96,20.19 20.22,19.94 20.29,19.84 21.26,18.87 21.26,18.52 21.11,18.36
  pour Top (no thermals): 25.1,18.59 25.35,18.34 26.29,18.34 26.42,18.47 26.42,19.28 26.54,19.41 29.36,19.41 29.51,19.56 30.1,19.56 30.07,19.58 29.54,19.58 28.88,20.24 26.09,20.24 25.78,19.94 25.78,19.46 25.32,19 25.1,18.87
  pour Top (no thermals): 40.16,18.36 40.13,18.34 39.14,18.34 39.01,18.47 39.01,19.28 38.89,19.41 35.43,19.41 35.28,19.56 34.7,19.56 34.72,19.58 35.26,19.58 35.94,20.27 39.27,20.27 39.57,19.96 39.57,19.91 39.6,19.86 39.47,19.71 40.31,18.87 40.31,18.49 40.18,18.36
  pour Top (no thermals): 44.4,18.34 45.24,18.34 45.42,18.52 45.42,19.28 45.57,19.43 49.02,19.43 49.15,19.56 49.83,19.56 49.81,19.58 49.17,19.58 48.49,20.27 45.11,20.27 44.75,19.91 45.19,19.91 44.15,18.87 44.15,18.59
  pour Top (no thermals): 59.18,18.47 59.05,18.34 57.89,18.34 57.86,18.36 57.86,19.23 57.68,19.41 55.14,19.41 54.99,19.56 54.38,19.56 54.41,19.58 54.97,19.58 55.6,20.22 58.24,20.22 58.39,20.07 58.39,19.71 58.42,19.63 59.18,18.87
  pour Top (no thermals): 63.25,18.34 64.16,18.34 64.24,18.41 64.24,19.25 64.39,19.41 66.85,19.41 67.01,19.56 67.61,19.56 67.59,19.58 66.95,19.58 66.29,20.24 64.49,20.24 63.96,19.71 63.75,19.71 62.97,18.92 62.97,18.54 63.14,18.36
  pour Top (no thermals): 76.63,18.34 75.67,18.34 75.54,18.47 75.54,19.28 75.41,19.41 72.82,19.41 72.67,19.56 72.14,19.56 72.16,19.58 72.64,19.58 73.28,20.22 75.49,20.22 76.83,18.87 76.83,18.54
  pour Top (no thermals): 95.3,18.97 95.07,18.97 94.89,19.15 94.72,19.25 94.59,19.38 90.65,19.41 90.5,19.56 89.92,19.56 89.94,19.58 90.47,19.58 91.11,20.22 92.71,20.22 95.48,20.19 95.99,19.68 96.01,19.71 95.99,19.61 95.83,19.48
  pour Top (no thermals): 81.89,19.38 84.61,19.38 84.79,19.56 85.37,19.56 85.34,19.58 84.76,19.58 84.05,20.29 81.86,20.29 81.25,19.68 81.33,19.68 80.49,18.85 80.49,18.49 80.67,18.31 81.64,18.31 81.81,18.49 81.81,19.3
  pour Top (rank 2, no thermals): 91.06,49.2 90.37,48.51 90.37,46.58 91.31,45.64 91.31,40.46 94.11,37.67 96.72,37.67 98.42,39.37 98.42,40.01 97.79,40.64 97.16,40.64 96.85,40.84 96.85,44.6 96.44,45.01 94.03,45.01 93.42,45.62 93.42,48.64 92.86,49.2
+12V2  (via drill 0.38, 0.5)
  Top 0.203: R50.2 28.99,73.34 D1.C | X9.2 44.64,81.41 44.64,80.52 45.09,80.07 45.09,77.22 45.72,76.58 45.72,74.99 44.58,73.85 R69.2 44.32,73.45 44.32,73.38 44.17,73.38 43.43,72.64 39.69,72.64 38.08,71.04 R41.2 | D6.C 8.89,72.93 8.89,72.39 8.4,71.9 R40.2 | v90.23,62.93 91.44,64.14 91.44,67.94 90.17,69.22 85.78,69.22 83.55,71.44 83.49,71.44 F3.P$2 | v74.55,52.83 R73.2 | R55.2 45.95,87.4 C60.1
  Top 0.305: 85.66,76.15 C65.+ 85.66,81.98
  Top 0.406: C60.1 45.95,91.1 45.97,91.12 46,91.16 45.09,92.08 45.09,93.34 45.72,93.98 X11.8 | v86.11,89.79 R3.2
  Top 0.559: U3.7 79.18,76.77 79.38,76.9
  Top 0.61: 79.38,76.9 79.38,77.98 79.76,78.36
  Top 0.813: D3.C 19.43,73.95 19.43,75.5 v19.05,75.69 | D6.C 9.53,74.93 v10.16,75.56 | D1.C 26.83,75.95 v26.8,75.95 | 83.26,84.38 C45.1
  Top 1.422: 85.66,81.98 83.26,84.38 | C40.1 79.76,77.6 79.76,78.36 79.76,83.5 80.58,84.33 81.67,84.33 C45.1
  Top 2.184: D8.C 81.72,71.56 F3.P$2 82.55,72.39 82.55,73.03 85.66,76.15
  15-SUPPLY 0.254: X35.2 20.32,86.18
  15-SUPPLY 0.813: 46.99,92.84 X11.8 46.99,92.71 44.26,89.98 X9.2 44.26,82.55 | v19.72,75.72 19.53,76.04 20.32,76.83
  15-SUPPLY 1.016: 20.32,86.18 20.32,76.83 20.32,76.52 v19.72,75.72 v19.05,75.69
  15-SUPPLY 1.422: 20.32,88.27 19.05,89.53 19.05,96.52 v18.41,97.16 | 20.32,86.18 20.32,88.27 | 20.32,88.27 25.4,88.27 | 25.4,88.27 29.21,88.27 30.48,87 X37.2 | X36.2 25.4,88.27
  Bottom 0.203: v90.23,62.93 89.53,62.23 89.53,54.61 89.03,54.1 75.82,54.1 v74.55,52.83
  Bottom 0.813: v10.16,75.56 10.73,76.14 18.67,76.14 | 18.67,76.14 v19.72,75.72 20.13,76.14 | v26.8,75.95 26.61,76.14 18.67,76.14
  other vias: 17.69,96.5 17.03,97.25 36.2,96.84 37.47,96.84 46.35,96.84 63.5,99.38 50.16,99.38 38.73,99.38 25.4,99.38 47.62,96.84 26.09,96.84 27.3,96.84 62.23,98.74 67.31,99.38 66.23,99.25 66.87,100.27 60.96,96.84 62.23,97.47 60.96,98.11 59.69,97.47 67.94,100.65 86.93,81.85 79.69,86.8 85.53,84.84 83.57,82.87 86.68,77.79 86.93,82.87 87,83.95 86.55,87.12 81.47,86.8
  pour Top (isolate 0.254, rank 3): 68.58,100.33 67.94,100.97 15.88,100.97 14.92,100.01 14.92,92.17 15.99,91.11 19.53,91.11 22.41,92.08 24.66,92.04 25.58,91.12 27.61,91.12 28.02,91.54 35.14,91.54 35.56,91.12 38.73,91.12 39.23,91.62 44.76,91.64 45.39,90.81 53.34,90.81 55.24,92.08 55.62,92.4 55.67,92.4 56.08,92.8 56.08,95.76 56.52,96.2 61.91,96.2 64.77,99.06 67.31,99.06
  pour 15-SUPPLY (isolate 0.406, rank 2): 16.2,99.7 16.2,97 17.2,96 59.9,96 61.28,95.95 61.98,95.25 78.74,95.25 79.38,94.61 79.38,83.82 85.72,77.47 86.68,77.47 87.31,78.11 87.31,98.11 84.14,101.28 50.67,101.28 50.04,100.65 17.13,100.65 16.21,99.72
  pour Top (isolate 0.406): 87.44,86.68 87.25,86.8 87,87.06 79.82,87.06 79.31,86.55 79.31,84.45 79.69,84.07 82.99,84.07 83.82,83.25 83.82,76.64 83.38,76.2 82.61,76.2 80.45,74.04 80.45,73.47 82.49,73.47 83.38,72.45 84.07,72.45 88.07,76.45 88.07,86.04
+12V3  (via drill 0.38)
  Top 0.203: v48.9,77.03 49.53,76.39 49.53,76.2 49.8,75.93 R58.2
  Top 0.61: 65.96,93.52 C66.+
  Top 0.813: 81.03,100.9 80.96,100.97 79.57,100.97
  Top 1.27: D7.C 65.96,93.52
  Top 1.676: F4.P$2 74.23,96.52 | 74.23,96.52 73.66,96.52 72.39,95.25 D7.C | 74.23,96.52 78.11,100.39 79.57,100.39
  15-SUPPLY 0.203: v48.9,77.03 46.1,77.03 45.72,77.41 45.72,89.53 47.94,91.76 57.15,91.76 57.47,92.08 v60.33,92.08
  15-SUPPLY 1.27: X38.2 64.14,90.81 v62.23,92.71
  other vias: 59.05,95.25 59.05,93.98 61.28,94.81 60.2,95.19 59.18,92.9 78.04,94.68 78.04,92.77 78.04,91.88 77.09,91.95 76.2,91.95 78.04,93.73 76.96,94.68
  pour Top (isolate 0.406, rank 2): 59.44,95.5 58.8,94.87 58.8,92.65 59.31,92.14 61.28,92.14 62.23,91.19 67.88,91.19 68.39,90.68 80.2,90.68 81.22,91.69 81.22,101.03 81.15,101.16 77.47,101.16 74.49,98.17 67.18,98.17 65.98,96.96 63.69,96.96 62.23,95.5
  pour 15-SUPPLY (isolate 0.406): 60.2,96.01 57.53,96.01 56.71,95.19 56.71,92.14 56.96,91.88 61.21,91.88 62.1,91 67.82,91 68.14,90.68 77.98,90.68 78.8,91.5 78.8,94.36 78.36,94.81 61.4,94.81
AREF
  Top 0.203: U2.98 64.15,63.42 64.39,63.18 65.41,63.18 65.91,63.69 65.91,68.79 C6.1
BED-HEAT
  Top 0.203: U2.7 58.02,68.88 58.23,69.09 58.23,70.04 57.15,71.12 57.15,72.39 57.78,73.03 59.67,73.03 R56.1 R57.1
D+  (via drill 0.38)
  Top 0.191: R2.1 13.97,59.78 | 13.97,59.78 12.86,59.78 v12.64,60.01 | Z2.2 13.92,59.83 13.97,59.78
  Bottom 0.191: v12.64,60.01 11.75,60.9 10.29,60.9 X2.3
D-  (via drill 0.38)
  Top 0.191: Z1.2 13.84,58.42 13.97,58.55 v12.57,58.55
  Top 0.203: 13.97,58.55 15.05,58.55 R1.1
  Bottom 0.191: v12.57,58.55 12.18,58.55 X2.2
DP-SS  (via drill 0.38)
  Top 0.203: v46.49,40.7 46.49,40.46 44.58,38.54 44.58,37.85 44.83,37.59 46.86,37.59 47.05,37.78 48.05,37.78 U4.P05 | v47.05,51.61 47.05,52.38 U2.50
  Bottom 0.203: v46.49,40.7 44.83,42.36 44.83,50.07 46.37,51.61 v47.05,51.61
DTR
  Top 0.191: 27.05,58.42 30.12,58.42 RN5.5 30.99,58.03 31.18,57.85 31.18,55.31 31.43,55.05 32.32,55.05 32.51,55.24 32.51,56.58 32.64,56.71 JP2.1 | U10.3 30.61,51.75 30.73,51.88 30.73,54.1 31.18,54.55 32.77,54.55 33.02,54.8 33.27,54.8 JP2.2
  Top 0.203: U1.13 24.83,59.56 24.89,59.5 25.97,59.5 27.05,58.42 | JP2.2 JP2.1
E0-DIR  (via drill 0.38)
  Top 0.203: U2.41 48.35,56.92 48.76,57.34 54.41,57.34 54.67,57.59 v54.74,57.59 | U8.20 61.79,20.57 61.28,21.08 61.28,25.88 TP11.TP 62.08,28.18 v62.08,30 | v56.52,33.02 55.88,33.66 55.88,40.26 55.19,40.95 54.23,40.95 54.1,41.08 v53.98,41.21
  Bottom 0.203: v54.74,57.59 54.9,57.18 54.9,46.33 54.29,45.72 54.29,41.52 v53.98,41.21 | v56.52,33.02 59.85,29.69 61.75,29.69 61.91,29.84 v62.08,30
E0-EN  (via drill 0.38)
  Top 0.203: U2.74 60.52,49.27 61.98,47.82 61.98,44.01 62.93,43.05 v63.41,43.05 | U8.5 77.72,20.57 78.42,21.27 78.42,25.4 TP14.TP 77.08,27.12 R62.2 76.16,28.82 76.16,31.64 72.96,34.83 72.96,42.1 71.71,43.35 71.71,43.38 v71.61,43.48
  Bottom 0.203: v63.41,43.05 63.83,43.48 v71.61,43.48
E0-MS1
  Top 0.203: U2.86 66.6,57.42 68.52,55.5 68.52,53.09 66.23,50.8 66.23,47.88 72.45,41.66 72.45,33.08 70.8,31.43 70.8,31.45 70.6,31.25 U8.11
E0-MS2
  Top 0.203: U2.85 66.46,56.92 68.07,55.31 68.07,53.21 65.79,50.93 65.79,47.69 72.01,41.47 72.01,33.44 70.17,31.6 70.17,31.61 70.1,31.55 U8.12
E0-REF  (via drill 0.38)
  Top 0.203: U8.18 66.54,21.57 65.49,22.62 65.49,24.77 TP12.TP | U4.P17 52.76,35.85 v52.73,35.83
  Bottom 0.203: v52.73,35.83 52.8,35.79 54.48,34.1 54.48,33.47 59.18,28.77 63.44,28.77 64.59,27.61 TP12.TP
E0-STEP  (via drill 0.38)
  Top 0.203: U2.56 51.52,51.41 50.9,52.03 50.9,54.12 51.68,54.9 58.23,54.9 58.64,54.6 v58.6,54.6 | v67.41,53.5 67.25,52.96 65.34,51.05 65.34,47.5 71.5,41.34 71.5,33.84 68.86,31.2 64.68,31.2 64.02,30.54 64.02,27 64.22,26.8 65.11,26.8 TP13.TP 67.45,24.46 U8.17
  Bottom 0.203: v58.6,54.6 58.66,54.61 58.97,54.74 62.04,54.74 62.8,53.98 66.93,53.98 v67.41,53.5
E1-DIR  (via drill 0.38)
  Top 0.203: U2.42 48.48,56.42 49,56.94 57.1,56.94 59.37,59.21 v59.37,59.82 | U9.20 79.76,20.57 79.06,21.27 79.06,25.34 79.49,25.77 TP15.TP 79.49,30.3 78.8,30.99 77.41,30.99 73.47,34.93 73.47,42.61 66.67,49.4 66.67,50.67 68.96,52.96 68.96,55.75 66.71,58.01 v66.26,58.07
  Bottom 0.203: v66.26,58.07 64.52,59.82 v59.37,59.82
E1-EN  (via drill 0.38)
  Top 0.203: v73.72,45.53 75.37,43.88 75.37,35.46 78.09,32.75 92.35,32.75 98.61,26.48 98.61,20.74 97.35,19.48 R63.2 | U2.75 61.02,49.35 62.42,47.94 62.42,44.67 v62.96,44.13 | 97.02,19.3 97.28,19.56 97.26,19.37 R63.2 | TP18.TP 97.07,19.2 R63.2
  Top 0.254: U9.5 96.12,20.57 96.52,20.17 97.03,20.17 97.23,19.96 97.23,19.39 R63.2
  Bottom 0.203: v73.72,45.53 64.36,45.53 v62.96,44.13
E1-MS1
  Top 0.203: U9.11 88.38,30.05 86.11,32.31 77.89,32.31 74.93,35.27 74.93,43.12 69.85,48.2 69.85,56.13 66.86,59.12 65.72,59.12 65.02,58.42 U2.88
E1-MS2
  Top 0.203: U9.12 87.88,29.91 85.92,31.88 77.72,31.88 74.42,35.18 74.42,43.05 69.41,48.07 69.41,55.94 66.61,58.74 65.98,58.74 65.16,57.92 U2.87
E1-REF  (via drill 0.38)
  Top 0.203: 54.15,37.78 U4.P20 52.75,37.8 v52.73,37.83 | U9.18 84.47,21.57 83.25,22.8 TP17.TP
  Bottom 0.203: v52.73,37.83 54.93,35.63 54.93,33.59 59.31,29.21 79.58,29.21 TP17.TP
E1-STEP  (via drill 0.38)
  Top 0.203: U2.57 52.02,51.55 51.38,52.19 51.38,53.89 51.95,54.47 52.01,54.47 57.53,54.47 58.51,53.49 v58.51,52.45 | U9.17 85.23,22.72 85.03,22.92 85.03,25.78 84.14,26.67 81.47,26.67 81.15,26.48 TP16.TP 80.86,30.71 80.14,31.43 77.57,31.43 73.91,35.09 73.91,42.93 67.5,49.34 v67.5,50.55
  Bottom 0.203: v58.51,52.45 60.42,50.55 v67.5,50.55
FAN-0  (via drill 0.38)
  Top 0.203: R48.1 34.35,68.77 34.39,68.66 R49.1 34.61,68.71 v35.5,68.71 | U2.17 53.02,67.44 52.13,68.33 52.13,68.83 v52.01,68.96
  Bottom 0.203: 35.43,68.77 v35.5,68.71 36.51,67.69 46.29,67.69 46.67,67.31 50.35,67.31 v52.01,68.96
FAN-1
  Top 0.203: U2.15 54.02,67.59 53.25,68.35 53.25,69.75 52.07,70.93 52.07,72.39 51.44,73.03 49.21,73.03 48.39,72.2 R54.1 47.31,73.3 47.31,74.55 47.82,75.06 47.82,76.52 47.5,76.83 46.35,76.83 45.72,77.47 45.72,85.45 R53.1
FAN-2  (via drill 0.38)
  Top 0.203: U2.6 58.52,68.8 58.67,68.96 58.67,70.23 58.42,70.48 X34.4 58.42,71.69 | R70.1 41.09,73.66 v39.12,73.66 38.3,73.66 37.79,73.15 R71.1
  Bottom 0.203: X34.4 57.15,73.03 49.53,73.03 47.43,75.12 40.58,75.12 40.26,75.44 39.5,75.44 39.12,75.06 v39.12,73.66
GND  (via drill 0.38, 0.5, 0.5 pad 0.1, 0.6)
  Top 0.203: R18.1 14.29,30.16 v14.27,30.42 | R12.1 v32.07,30.48 | 12.06,74.93 Q1.1 Q1.2 Q1.3 | 12.06,74.93 v11.87,74.74 v12.57,74.74 | v12.57,74.74 v13.27,74.74 v13.97,74.74 | v12.57,74.74 12.06,74.93 | v24.13,74.99 v22.86,74.99 v21.59,74.99 | 22.86,76.2 22.86,75.25 | Q3.3 Q3.2 Q3.1 | v33.02,74.93 v34.35,74.93 34.42,74.87 36.2,74.87 | Q5.3 Q5.2 Q5.1 | 53.98,75.25 v53.98,74.93 v53.02,74.93 | v57.78,73.98 v56.83,73.98 v55.88,73.98 | v55.88,73.98 v54.61,73.98 | v56.52,74.93 56.52,74.61 v55.88,73.98 | v52.84,33.03 53.24,33.26 U4.P13 55.23,33.26 55.44,33.47 55.44,35.18 | v68.9,19.37 v68.9,21.27 | v70.8,20.32 71.12,20.32 | v69.85,19.37 v70.8,19.37 | v86.68,19.37 U9.33 | U2.81 61.28,54.92 v60.78,55.43 | U2.62 54.52,49.48 55.99,48.01 58.8,48.01 | R54.2 48.67,73.47 52.83,73.47 53.28,73.91 53.34,73.91 | R52.2 36.39,74.87 | 36.39,74.87 36.2,74.87 | R43.2 10.79,68.87 10.83,68.83 v11.75,68.83 | U4.P03 48.06,39.12 46.35,39.12 46.16,38.92 C55.2 | U4.P24 55.16,40.41 55.44,40.13 55.44,38.61 | U4.P21 54.19,38.48 55.31,38.48 55.44,38.61 | U4.P16 55.4,35.2 55.44,35.18 | 55.44,35.18 55.44,38.61 | 46.04,38.32 C55.2 | D19.A 76.77,35.88 v76.07,35.88 | X29.1 89.53,44.45 89.64,44.35 v89.64,43.19 | X3.1 v90.11,36.58 | C56.2 80,46.55 v79.06,46.55 | 76.52,47.05 v76.52,47.76 76.52,48.52 D13.A | v82.74,41.03 81.82,41.03 C64.2 | v76.07,40.14 D17.A | v34.8,30.48 C36.1 | 58.8,48.01 59.3,47.36 | v58.8,47.97 58.84,48.01 58.8,48.01 | 42.71,62.95 42.69,62.93 v41.81,62.93 | LED1.C 1.84,73.6 | 1.84,73.6 v1.84,75.03 | LED7.C 1.84,70.86 1.84,73.6 | v68.58,30.38 68.58,29.49 R22.1 | v71.66,30.43 71.66,29.52 C46.1 | v89.47,30.43 89.47,29.44 C51.1 | v86.39,30.38 86.39,29.46 R26.1
  Top 0.203: U4.P04 46.17,38.45 C55.2 | v90.08,51.06 87.56,51.06 87.44,51.18 87.44,52.3 X28.1 | v90.52,61.6 87.7,61.6 87.44,61.34 87.44,60.23 X27.1 | C59.2 81.76,50.3 v82.8,50.3 | D12.A 71.37,50.53 v71.37,49.79 | v74.68,48.58 73.44,48.58 C3.2 | C6.2 68.48,69.8 v68.48,68.33 | 64.2,90.08 C62.2 64.2,89.85 | U2.11 56.02,67.78 v55.45,68.34 | U2.99 64.84,63.92 v64.86,63.94 64.9,63.98 C26.2 | 36.33,74.81 36.39,74.87 | v49.67,30.63 49.67,29.84 C18.2 | v65.86,55.62 65.04,55.62 C8.2 | 41.53,57.09 41.53,56.33 41.66,56.2 | 36.25,52.4 36.58,52.4 36.85,52.68 36.88,52.68 36.88,52.4 | R71.2 36.47,74.59 36.2,74.87 | v65.41,74.3 R57.2
  Top 0.254: U2.32 44.91,61.42 | 44.24,61.42 42.82,62.84 | 42.82,62.84 C9.2 | 42.82,62.84 42.71,62.95
  Top 0.305: 31.64,21.07 U6.33 | 69.1,21.07 U8.33 | 86.88,21.07 U9.33 | U5.33 13.22,21.07 11.5,21.07 | 44.91,61.42 44.24,61.42
  Top 0.406: 44.39,89.18 C60.2 44.3,89.31 v43.24,90.36 | C30.2 67.44,80.52 67.5,80.45
  Top 0.508: C24.2 12.44,29.49 v12.44,30.4 | C23.2 30.22,29.5 v30.22,30.44 | v66.77,30.46 66.77,29.29 C17.2 | v84.58,30.48 C4.2
  Top 0.61: C31.1 17.02,29.4 17.14,29.4 17.46,29.72 v17.46,30.35 | v45.34,38.32 46.04,38.32 | 64.2,89.85 64.39,89.79 v65.41,89.79 | v6.81,7.82 CF4.2@1 CF3.2@1 v12.53,7.82 13.36,7.82 | CF12.2@2 CF12.2@1 | CF12.2@1 v44.05,7.8 | CF12.2@1 v46.59,7.8 CF11.2@1 v47.86,7.8 CF11.2@2 50.36,7.8 D28.A | CF9.2@2 CF9.2@1 | CF9.2@1 CF10.2@2 v56.24,7.8 CF10.2@1 v54.97,7.8 53.7,7.8 D30.A | CF9.2@1 v60.05,7.8 | CF1.2@2 CF2.2@1 | CF2.2@1 16.99,7.85 D23.A | CF2.2@1 v23.27,7.85 | CF8.2@1 CF7.2@2 | CF7.2@2 30.59,7.82 D25.A | CF7.2@2 v24.39,7.82 | CF5.2@2 34.03,7.8 D27.A | CF6.2@1 v40.27,7.82 | CF16.2@1 CF15.2@2 | CF15.2@2 68.05,7.8 D32.A | CF15.2@2 v61.8,7.8 | CF13.2@2 71.6,7.8 D35.A | CF14.2@1 77.83,7.77 v77.86,7.8 | CF19.2@2 CF20.2@1 | CF20.2@1 v79.76,7.8 | CF20.2@1 85.96,7.8 D38.A | CF17.2@2 CF18.2@1 | CF18.2@1 89.35,7.8 D37.A | CF18.2@1 v95.56,7.8
  Top 0.711: 7.5,17.96 C71.2
  Top 0.813: 6.73,17.31 6.73,17.95 7.57,17.98 6.73,17.98 6.73,17.2 7.5,17.96 | 67.5,80.45 v67.5,78.61 | v68.58,80.52 67.56,80.52 67.5,80.58 v67.5,82.36 | C54.2 62.06,89.98 v62.93,89.98
  other vias: 51.47,30.44 54.34,29.43 90.08,33.79 91.35,58.93 31.75,74.93 30.92,76.07 9.84,101.92 93.03,0.95 103.19,75.88 39.27,63.25 44.07,33.23 53.02,75.88 55.24,74.93 53.34,73.98 95.76,21.34 74.68,78.93 0.95,68.26 75.31,76.14 74.28,31.23 88.58,20.32 86.68,20.32 88.58,19.37 87.63,19.37 86.68,21.27 87.63,21.27 88.58,21.27 68.9,20.32 13.97,21.27 14.92,21.27 13.02,21.27 14.92,20.32 13.02,20.32 13.02,19.37 13.97,19.37 14.92,19.37 32.38,21.27 33.34,21.27 31.43,21.27 33.34,20.32 31.43,20.32 31.43,19.37 32.38,19.37 33.34,19.37 52.07,21.27 53.02,21.27 51.12,21.27 53.02,20.32 51.12,20.32 51.12,19.37 52.07,19.37 53.02,19.37 95.76,67.78 93.56,67.38 95.76,64.32 98.56,66.08 95.76,74.49 95.76,77.91 95.66,84.72 95.76,87.95 98.42,86.38 98.48,76.22 92.97,76.12 97.37,47.65 96.86,49.17 95.1,49.16 95.13,46.11 95.95,46.11 96.84,46.11 95.97,49.19 93.56,64.74 10.64,42.55 3.34,40 51.47,48.19 90.49,101.92 74.87,73.28 93.08,86.38 74.61,99.57 70.17,99.57 72.39,101.03 73.66,101.03 71.12,101.03 74.93,101.03 69.85,101.03 74.3,101.92 73.03,101.92 71.75,101.92 75.56,101.92 69.85,20.32 69.85,21.27 70.8,21.27 87.63,20.32 52.07,20.32 32.38,20.32 13.97,20.32 22.47,14.71 19.02,11.61 4.76,19.37 84.14,23.18 90.3,24.45 82.23,21.91 82.23,23.81 80.33,23.81 77.15,23.81 75.25,23.81 77.15,21.91 75.25,21.91 72.52,23.18 66.36,23.18 64.45,23.81 64.45,21.91 62.55,23.81 62.55,21.91 59.37,21.91 59.37,23.81 57.47,23.81 57.47,21.91 54.8,23.18 48.58,23.18 46.04,23.81 46.04,21.91 40.32,23.81 38.42,23.81 40.32,21.91 38.42,21.91 35.24,23.18 28.89,23.18 26.99,23.81 26.99,21.91 25.08,23.81 25.08,21.91 20.64,21.32 16.64,23.18 6.03,11.75 6.03,13.65 4.13,13.65 6.03,15.56 4.13,15.56 6.72,17.21 4.76,17.46 8.57,21.91 6.67,21.91 4.76,21.91 10.48,23.18 6.67,23.81 4.76,23.81 43,49.64 40.72,52.05 70.61,74.23 42.16,77.09 43.12,77.98 44.01,77.09 41.72,87.38 41.72,84.65 40.83,85.28 48.65,55.65 39.77,61.34 38.7,58.1 35.72,47.69 41.56,57.09 43.72,58.1 44.1,61.28 52.64,40.42 0.95,72.26 0.95,75.83 0.95,79.83 0.95,83.83 0.95,87.83 0.95,91.83 0.95,95.83 5.84,101.92 13.84,101.92 17.84,101.92 21.84,101.92 25.84,101.92 29.84,101.92 33.84,101.92 37.84,101.92 41.84,101.92 45.84,101.92 49.84,101.92 53.84,101.92 57.84,101.92 61.84,101.92 65.84,101.92 69.84,101.92 77.41,101.93 81.85,101.93 86.49,101.92 94.49,101.92 98.49,101.92 103.19,79.88 103.19,83.88 103.19,87.88 103.19,91.88 103.19,95.88 103.19,71.88 103.19,67.88 103.19,63.88 103.19,59.88 103.19,55.88 103.19,51.88 103.19,47.88 103.19,43.88 103.19,39.88 103.19,35.88 103.19,31.88 103.19,27.88 103.19,23.88 103.19,19.88 103.19,15.88 103.19,11.88 103.19,7.88 97.03,0.95 89.03,0.95 85.03,0.95 81.03,0.95 77.03,0.95 73.03,0.95 69.03,0.95 65.03,0.95 61.03,0.95 57.03,0.95 53.03,0.95 49.03,0.95 45.03,0.95 41.03,0.95 37.03,0.95 33.03,0.95 29.03,0.95 25.03,0.95 21.03,0.95 17.03,0.95 13.03,0.95 9.03,0.95 1.02,45.86 1.02,5.86 1.02,9.86 1.02,13.86 1.02,17.86 1.02,21.86 1.02,25.86 1.02,29.86 1.02,33.86 1.02,37.86 1.02,41.86 5.03,0.95 36.63,56.5 4.76,80.65 74.87,70.1 44.13,21.91 44.13,23.81 35.34,65.85 61.5,58.52 58.9,55.98 60.23,63.15 57.5,60.04 50.07,52.42 94.62,47.69 88.14,31.88 92.46,21.34 60.11,18.68 92.2,24.45 92.2,26.35 94.11,24.45 94.11,26.35 96.01,26.35 97.92,16.19 10.48,24.45 70.93,77.85 73.41,71.5 76.39,71.56 76.45,70.17 76.45,72.96 81.72,88.07 81.72,91 83.12,80.71 81.66,82.36 81.66,78.99 83.19,77.34 68.96,89.73 7.81,75.83 7.05,70.37 23.81,27.56 52.8,65.12 66.42,97.35 90.55,80.84 75.95,75.5 74.68,75.5 74.68,76.77 75.95,76.77 77.66,18.66 62.06,18.68 43.27,18.66 41.11,18.66 24.22,18.68 22.09,18.68 22.8,19.67 23.53,19.67 18.54,23.18 41.87,19.62 42.58,19.62 60.69,19.65 61.43,19.65 78.27,19.7 94.01,21.35 22.42,21.81 21.68,26.81 21.48,23.84 20.73,7.85 19.44,7.85 18.12,7.85 22,7.85 29.47,7.82 9.35,7.82 8.08,7.82 11.26,7.82 19.6,11.61 11.58,11.61 10.97,11.61 14.12,8.94 13.51,8.94 17.01,8.97 16.43,8.97 21.81,14.71 9.06,11.94 8.4,11.94 9.99,7.82 15.27,7.62 28.2,7.82 26.93,7.82 25.66,7.82 35.19,7.82 37.73,7.82 36.46,7.82 39,7.82 32.34,7.62 25.36,11.81 25.99,11.81 27.95,11.58 28.56,11.58 30.49,8.92 31.1,8.92 33.51,8.92 34.12,8.92 36.71,11.61 36.1,11.61 38.69,11.84 39.3,11.84 49.13,7.8 52.05,7.77 57.51,7.8 58.78,7.8 65.61,7.8 66.88,7.8 64.34,7.8 63.07,7.8 69.83,7.62 74.05,7.8 72.78,7.8 75.32,7.8 76.59,7.8 84.84,7.8 90.48,7.8 91.75,7.8 93.02,7.8 94.29,7.8 87.66,7.52 83.57,7.8 82.3,7.8 81.03,7.8 32.32,16.7 32.35,14.67 6.72,17.97 52.01,16.7 52.03,14.67 52.03,12.76 69.79,16.7 69.81,14.67 69.81,12.76 87.57,16.7 87.57,14.8 87.57,12.89 45.32,11.86 48.04,11.58 50.76,9.22 50.12,9.22 44.68,11.86 47.4,11.58 53.3,9.22 53.93,9.22 55.96,11.61 56.6,11.61 58.6,11.86 59.24,11.86 62.59,11.84 63.23,11.84 65.26,11.58 65.89,11.58 68.56,8.94 67.93,8.94 71.08,8.92 71.71,8.92 73.79,11.58 74.43,11.58 77.04,11.84 76.41,11.84 81.29,11.84 80.65,11.84 83.9,11.58 83.27,11.58 86.44,8.92 85.81,8.92 89.44,8.92 88.8,8.92 91.37,11.63 92.01,11.63 93.99,11.84 94.62,11.84 13.91,16.7 13.91,14.16 15.3,12.97 32.35,12.76 79.08,19.7 79.67,18.66 18.05,18.55 18.05,16.65 19.95,16.65 28.44,18.58 28.44,16.68 26.53,16.68 24.63,16.68 36.33,18.55 36.33,16.65 38.24,16.65 40.14,16.65 48.2,18.55 48.2,16.65 46.29,16.65 44.39,16.65 55.97,18.58 55.97,16.68 57.87,16.68 59.78,16.68 65.98,18.61 65.98,16.7 64.07,16.7 62.17,16.7 73.75,18.61 73.75,16.7 75.65,16.7 77.56,16.7 83.76,18.58 83.76,16.68 81.85,16.68 79.95,16.68 91.53,18.55 91.53,16.65 93.43,16.65 95.34,16.65 93.43,18.55 80.33,21.91
  pour 2-GND (isolate 0.203, rank 2): 0,102.87 0,0 104.14,0 104.14,102.87
  pour Bottom (isolate 0.203, rank 3): 0,102.87 0,0 104.14,0 104.14,102.87
  pour Bottom (isolate 0.406, rank 2): 91.44,88.9 99.06,88.9 99.06,63.5 91.44,63.5
  pour Top (isolate 0.203, rank 3, no thermals): 86.04,69.22 66.48,69.22 66.48,90.04 86.04,90.04
  pour Top (isolate 0.203, rank 4): 19.48,102.87 19.57,102.87 19.66,102.87 104.2,102.87 104.14,40.01 104.17,0 0,0 0,102.85
  pour 15-SUPPLY (isolate 0.203, rank 4): 0,102.87 104.14,102.87 104.14,0 0,0
  pour Top (no thermals): 97.28,45.91 97.28,49.08 96.65,49.72 95.06,49.72 94.74,49.4 94.74,45.91 95.06,45.59 96.97,45.59
  pour Top (no thermals): 93.8,11.18 93.7,11.28 93.7,11.84 93.98,12.12 94.59,12.12 94.89,11.81 94.89,11.35 94.72,11.18
  pour Top (no thermals): 91.16,11.02 91.08,11.1 91.08,11.63 91.36,11.91 92,11.91 92.28,11.63 92.28,11.13 92.18,11.02
  pour Top (no thermals): 83.19,10.92 82.98,11.13 82.98,11.56 83.29,11.86 83.9,11.86 84.1,11.66 84.1,11.63 84.15,11.58 84.15,11.07 84,10.92
  pour Top (no thermals): 80.57,11.15 80.37,11.35 80.37,11.84 80.64,12.12 81.28,12.12 81.53,11.86 81.53,11.38 81.31,11.15
  pour Top (no thermals): 76.3,11.23 76.15,11.38 76.15,11.86 76.4,12.12 77.04,12.12 77.32,11.84 77.32,11.4 77.14,11.23
  pour Top (no thermals): 73.71,10.92 73.51,11.13 73.51,11.61 73.76,11.86 74.45,11.86 74.73,11.58 74.73,11.1 74.57,10.95 73.71,10.95
  pour Top (no thermals): 88.72,8.2 88.52,8.41 88.52,8.89 88.82,9.19 89.43,9.19 89.71,8.92 89.71,8.38 89.53,8.2
  pour Top (no thermals): 85.72,8.23 85.52,8.43 85.52,8.89 85.83,9.19 86.44,9.19 86.72,8.92 86.72,8.38 86.56,8.23
  pour Top (no thermals): 70.99,8.36 70.79,8.56 70.79,8.89 71.09,9.19 71.68,9.19 71.98,8.89 71.98,8.53 71.81,8.36
  pour Top (no thermals): 67.94,8.26 67.64,8.56 67.64,8.97 67.89,9.22 68.58,9.22 68.83,8.97 68.83,8.53 68.55,8.26
  pour Top (no thermals): 65.2,11.02 64.97,11.25 64.97,11.61 65.23,11.86 65.86,11.86 66.14,11.58 66.14,11.18 65.99,11.02
  pour Top (no thermals): 62.59,11.2 62.33,11.46 62.33,11.84 62.61,12.12 63.25,12.12 63.5,11.86 63.5,11.46 63.25,11.2
  pour Top (no thermals): 58.62,11.07 58.34,11.35 58.34,11.89 58.6,12.14 59.26,12.14 59.51,11.89 59.51,11.35 59.23,11.07
  pour Top (no thermals): 55.96,10.82 55.68,11.1 55.68,11.63 55.93,11.89 56.62,11.89 56.87,11.63 56.87,10.97 56.72,10.82
  pour Top (no thermals): 53.31,8.15 53.01,8.46 53.01,8.92 53.31,9.22 53.95,9.22 54.2,8.97 54.2,8.43 53.92,8.15
  pour Top (no thermals): 49.99,8.41 49.83,8.56 49.83,9.27 50.09,9.53 50.77,9.53 51,9.3 51,8.61 50.8,8.41
  pour Top (no thermals): 47.29,10.95 47.12,11.13 47.12,11.61 47.37,11.86 48.03,11.86 48.31,11.58 48.31,11.15 48.11,10.95
  pour Top (no thermals): 44.6,11.18 44.42,11.35 44.42,11.91 44.65,12.14 45.36,12.14 45.59,11.91 45.59,11.18
  pour Top (no thermals): 38.58,11.18 38.43,11.33 38.43,11.89 38.66,12.12 39.34,12.12 39.57,11.89 39.57,11.3 39.45,11.18
  pour Top (no thermals): 35.97,10.95 35.84,11.07 35.84,11.66 36.07,11.89 36.73,11.89 36.98,11.63 36.98,11.15 36.78,10.95
  pour Top (no thermals): 33.43,8.18 33.25,8.36 33.25,8.94 33.5,9.19 34.14,9.19 34.39,8.94 34.39,8.38 34.19,8.18
  pour Top (no thermals): 30.28,8.26 30.23,8.31 30.23,8.94 30.48,9.19 31.11,9.19 31.37,8.94 31.37,8.33 31.29,8.26
  pour Top (no thermals): 27.89,11.89 27.69,11.68 27.69,11.48 27.69,10.95 27.76,10.87 28.65,10.87 28.83,11.05 28.83,11.61 28.55,11.89
  pour Top (no thermals): 25.35,12.09 25.1,11.84 25.1,11.33 25.17,11.25 26.14,11.25 26.24,11.35 26.24,11.86 26.01,12.09
  pour Top (no thermals): 8.28,11.2 8.13,11.35 8.13,11.91 8.43,12.22 9.02,12.22 9.35,11.89 9.35,11.46 9.09,11.2
  pour Top (no thermals): 10.79,10.87 10.69,10.97 10.69,11.58 11,11.89 11.53,11.89 11.86,11.56 11.86,11.13 11.61,10.87
  pour Top (no thermals): 13.16,8.33 13.16,8.94 13.44,9.22 14.22,9.22 14.38,9.07 14.38,8.41 14.3,8.33
  pour Top (no thermals): 16.15,8.43 16.15,8.99 16.41,9.25 17.02,9.25 17.3,8.97 17.3,8.48 17.2,8.38 16.21,8.38
  pour Top (no thermals): 18.82,10.97 18.75,11.05 18.75,11.63 19,11.89 19.63,11.89 19.89,11.63 19.89,11 19.86,10.97
  pour Top (no thermals): 21.54,14.71 21.54,15.14 22.76,15.14 22.76,14.71 22.48,14.43 21.82,14.43
GND1  (via drill 0.38)
  Top 0.203: U1.33 21.46,59.24 v20.51,58.36 20.16,58.1 20.7,58.1 20.71,58.09 U1.3 20.71,55.02 20.9,54.84 20.9,54.14 | 19.56,51.33 Y2.2 | U10.4 28.77,51.12 28.64,50.99 28.19,50.99 28,51.18 | 19.65,51.24 Y2.2 | C12.2 19.77,51.12 Y2.2
  other vias: 17.53,59.88 17.21,56.58 18.8,54.99 20.52,60.26 14.93,60.9 15.24,56.96 16.71,52.39 18.36,50.23 18.99,48.32 22.17,48.32 21.72,52.64 23,50.56 18.74,52.39 25.4,51.94 27.06,48.17 28.01,51.12 9.09,62.23 7.31,60.26 8.64,55.24 33.28,64.83 26.87,66.48 0.96,65.47 0.96,48.32 13.15,65.53 11.69,48.26 7.82,48.32 4.13,65.47 34.42,57.98 0.96,52.32 0.96,56.32 0.96,60.32 0.96,64.32 29.98,54.29 13.07,52.72 13.12,54.37
  pour 15-SUPPLY: 6.35,60.33 6.35,56.52 8.26,54.61 13.97,54.61 15.88,56.52 15.88,60.33 13.34,62.87 8.89,62.87
  pour 2-GND (isolate 0.203): 0.06,66.67 10.79,66.67 12.45,68.33 12.45,69.53 12.95,70.04 12.95,71.37 13.65,72.07 33.34,72.07 33.97,71.44 33.97,66.29 35.43,64.83 35.43,54.61 34.16,53.34 34.16,47.82 33.59,47.24 0.06,47.24
  pour Top (isolate 0.203): 0.06,67.56 12.45,67.56 13.59,66.61 13.59,71.37 14.29,72.07 32.7,71.44 33.34,70.8 33.34,65.66 34.8,64.2 34.8,54.57 34.16,53.94 32.89,53.94 32.13,53.17 32.13,48.45 31.56,47.88 0.06,47.88
  pour Bottom (isolate 0.203, rank 2): 0.06,66.04 13.97,66.04 15.24,67.31 15.24,69.85 16.19,70.8 32.7,70.8 33.34,70.17 33.34,65.66 34.8,64.2 34.8,54.55 34.23,53.98 32.89,53.98 32.13,53.21 32.13,47.82 31.56,47.24 0.06,47.24
  pour 15-SUPPLY (isolate 0.203): 0.06,66.67 13.65,66.67 13.65,47.05 0.06,47.05
HEAT-0  (via drill 0.38)
  Top 0.203: v50.45,69.69 50.64,69.25 52.52,67.37 U2.18 | R42.1 16.83,74.13 | R43.1 9.08,68.94 9.08,71.37 9.59,71.88 12.7,71.88 13.96,73.14 16.56,73.14 16.83,73.41 16.83,74.14 R42.1 | v16.95,75.11 16.95,74.27 R42.1
  Bottom 0.203: v50.45,69.69 50.04,70.1 48.26,70.1 47.88,70.48 47.88,72.52 46.42,73.98 40.64,73.98 39.62,72.96 38.61,72.96 37.4,74.17 17.89,74.17 v16.95,75.11
HEAT-1  (via drill 0.38)
  Top 0.203: R51.1 R52.1 38.87,74.61 v39.88,74.61 | U2.16 53.52,67.52 52.82,68.21 52.82,69.48 51.82,70.48 49.02,70.48 v48.64,70.87
  Bottom 0.203: v48.64,70.87 48.64,72.71 46.74,74.61 v39.88,74.61
L13  (via drill 0.38)
  Top 0.203: U2.26 47,64.44 v47,68.1 | v7.68,73.66 7.22,73.66 R33.1
  Bottom 0.203: v47,68.1 47.54,67.94 49.97,67.94 50.54,68.51 | X34.3 55.69,71.56 55.31,71.56 54.23,70.48 52.51,70.48 50.54,68.51 | v7.68,73.66 37.34,73.66 38.42,72.58 39.81,72.58 40.77,73.53 46.23,73.53 47.37,72.39 47.37,70.36 48.07,69.66 49.41,69.66 50.54,68.53 50.54,68.51
MISO2  (via drill 0.38)
  Top 0.203: U1.17 23.8,61.71 v24.32,61.98
  Bottom 0.203: v24.32,61.98 24.32,58.36 24.77,57.91 25.97,57.91 27.5,59.44 27.5,59.88 X17.1
MOSI2
  Top 0.203: U1.16 24.67,61.06 25.02,61.4 29.02,61.4 X17.4
N$1
  Top 0.203: U5.10 15.22,25.25 16.83,26.86 16.8,27.62 C31.2
N$2
  Top 0.203: LED1.A 5.68,73.59 R33.2
N$3
  Top 0.203: LED7.A 4.28,70.42 5.53,70.42 R35.2
N$4
  Top 0.254: U6.32 34.13,17.3 34.29,16.97
  Top 0.61: 34.29,16.97 34.29,14.33 35.18,13.44 36.3,13.44 R8.1